# EasyEDA Pro project QFP100测试座转接_2024-04-13.epro

# Schematic Schematic1

## Sheets
1 P1: Create Date: 2024-04-13; Page Name: P1; Project Name: QFP100测试座转接; Schematic Name: Schematic1; Update Date: 2024-04-13; Company: 嘉立创EDA; Page Size: A4; Version: V1.0
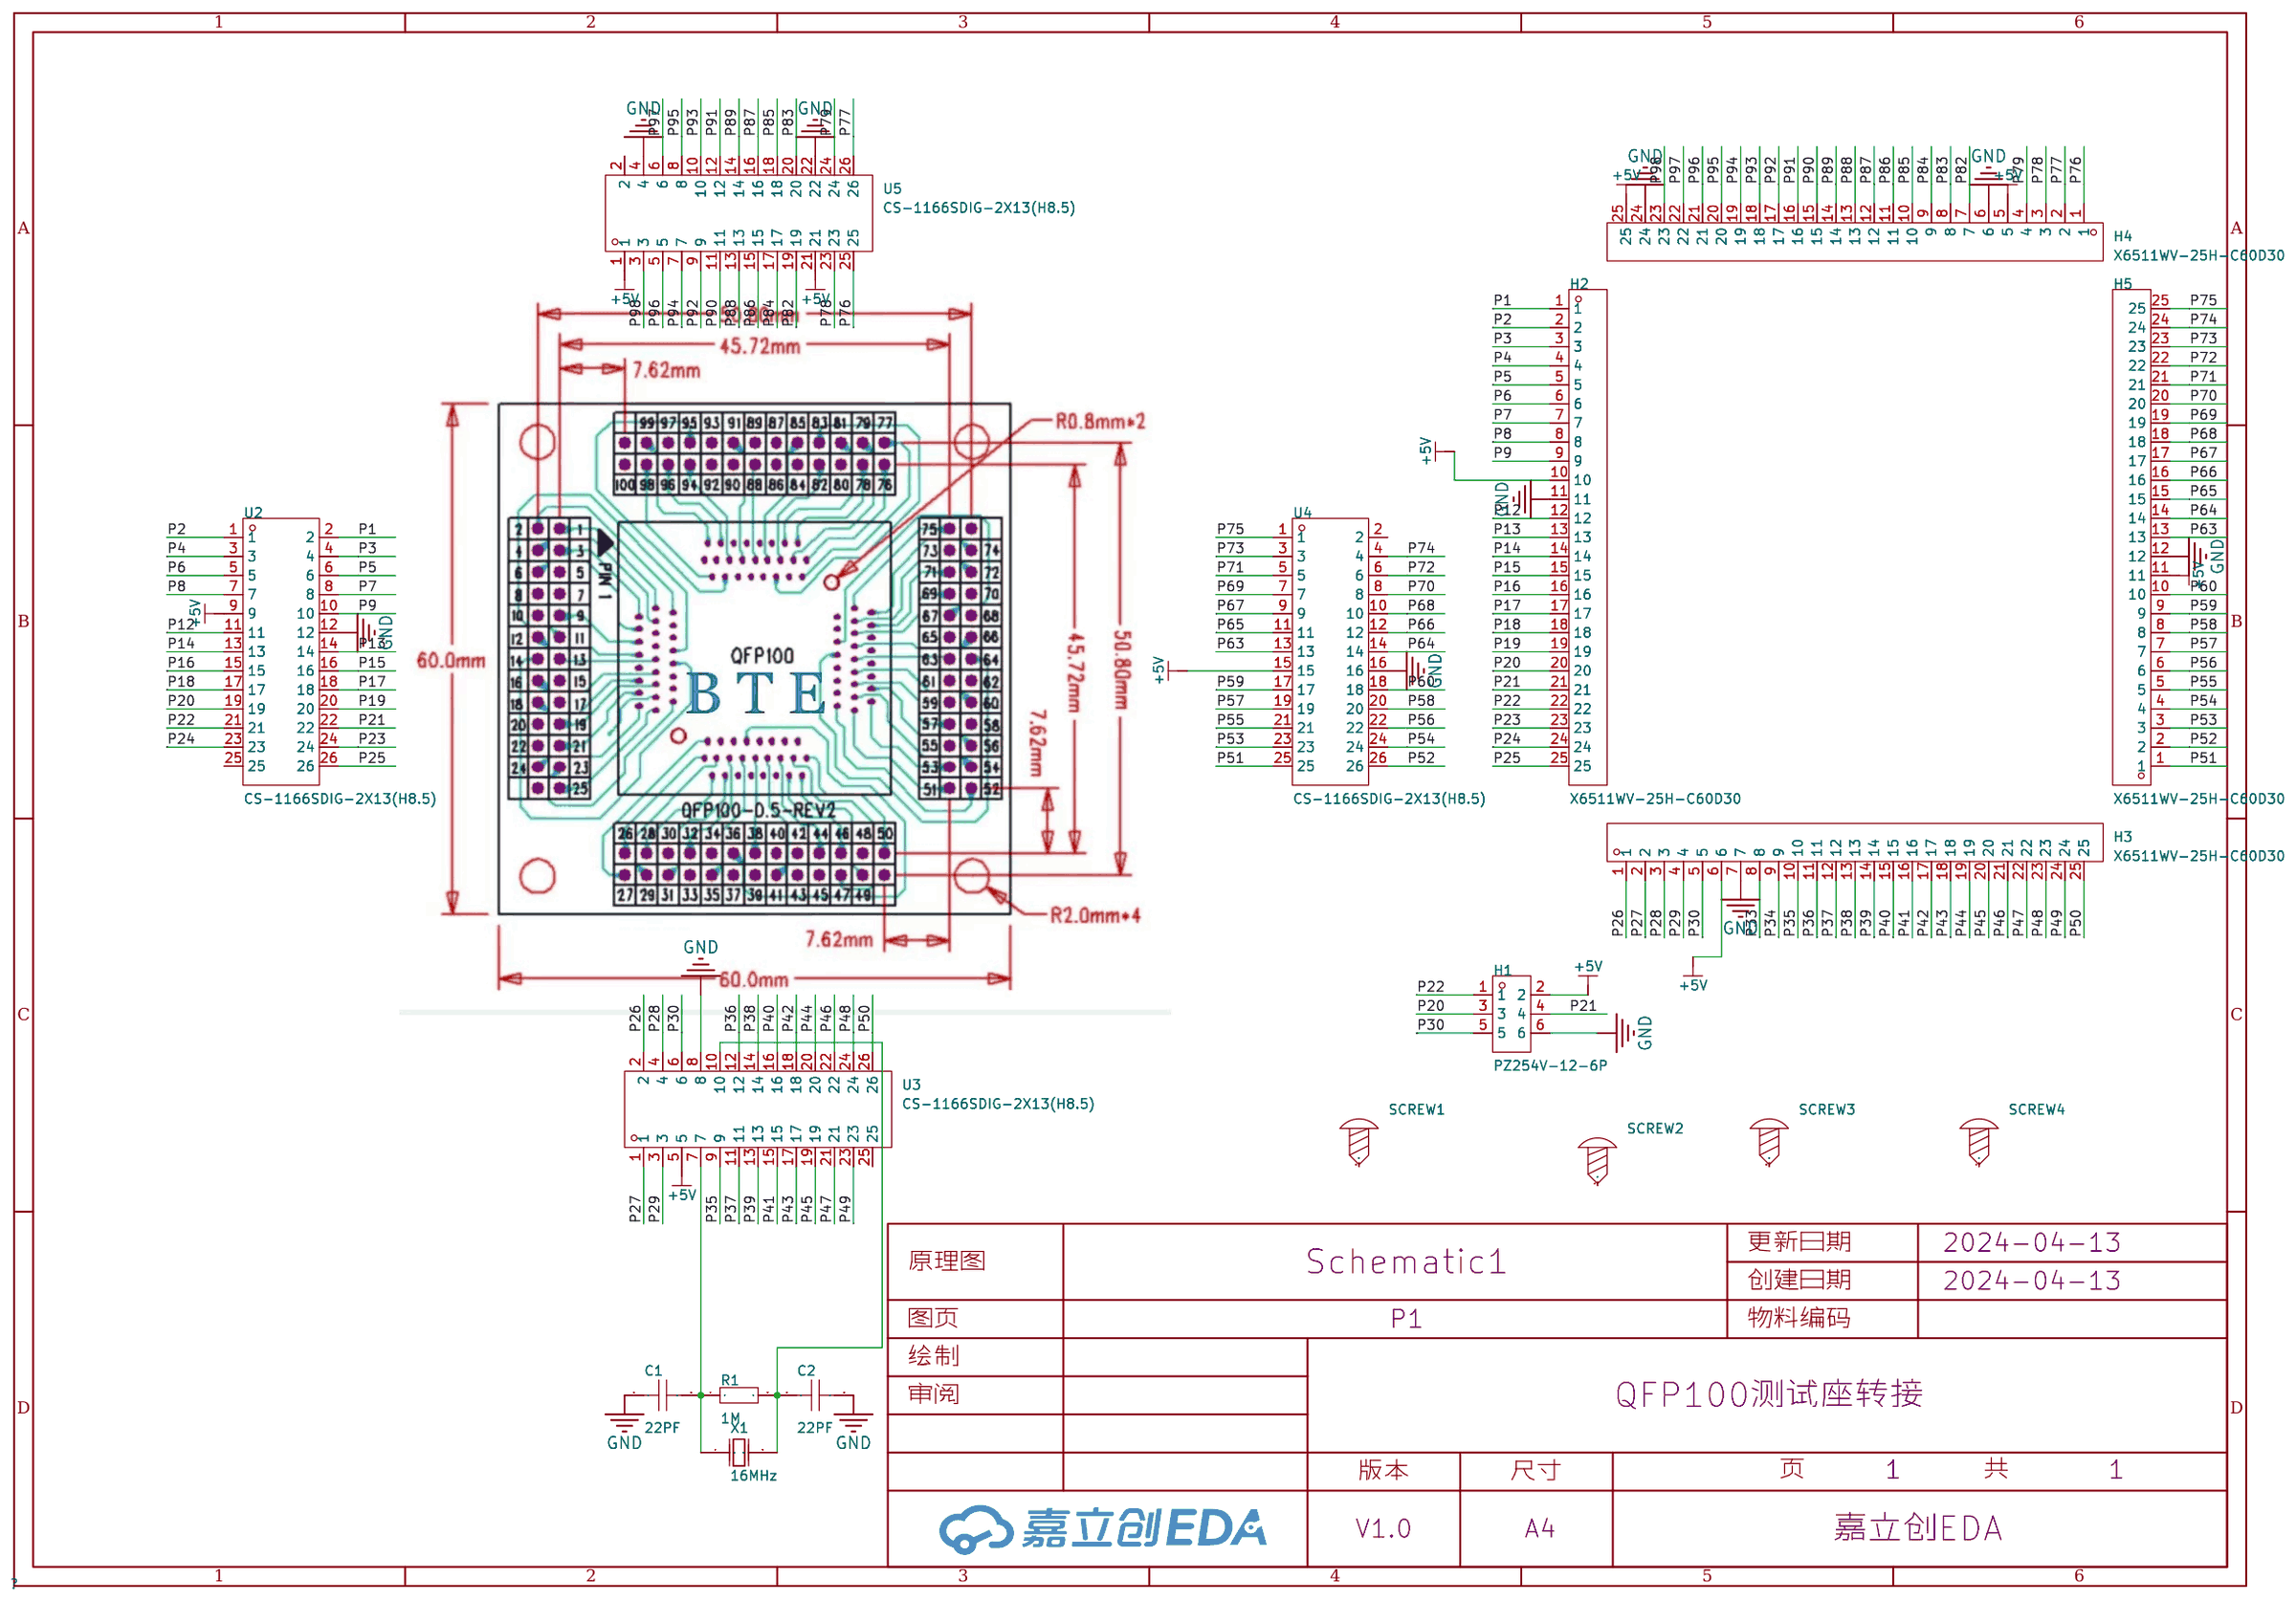
[diagram p0: P1]
2 P2: Page Name: P2
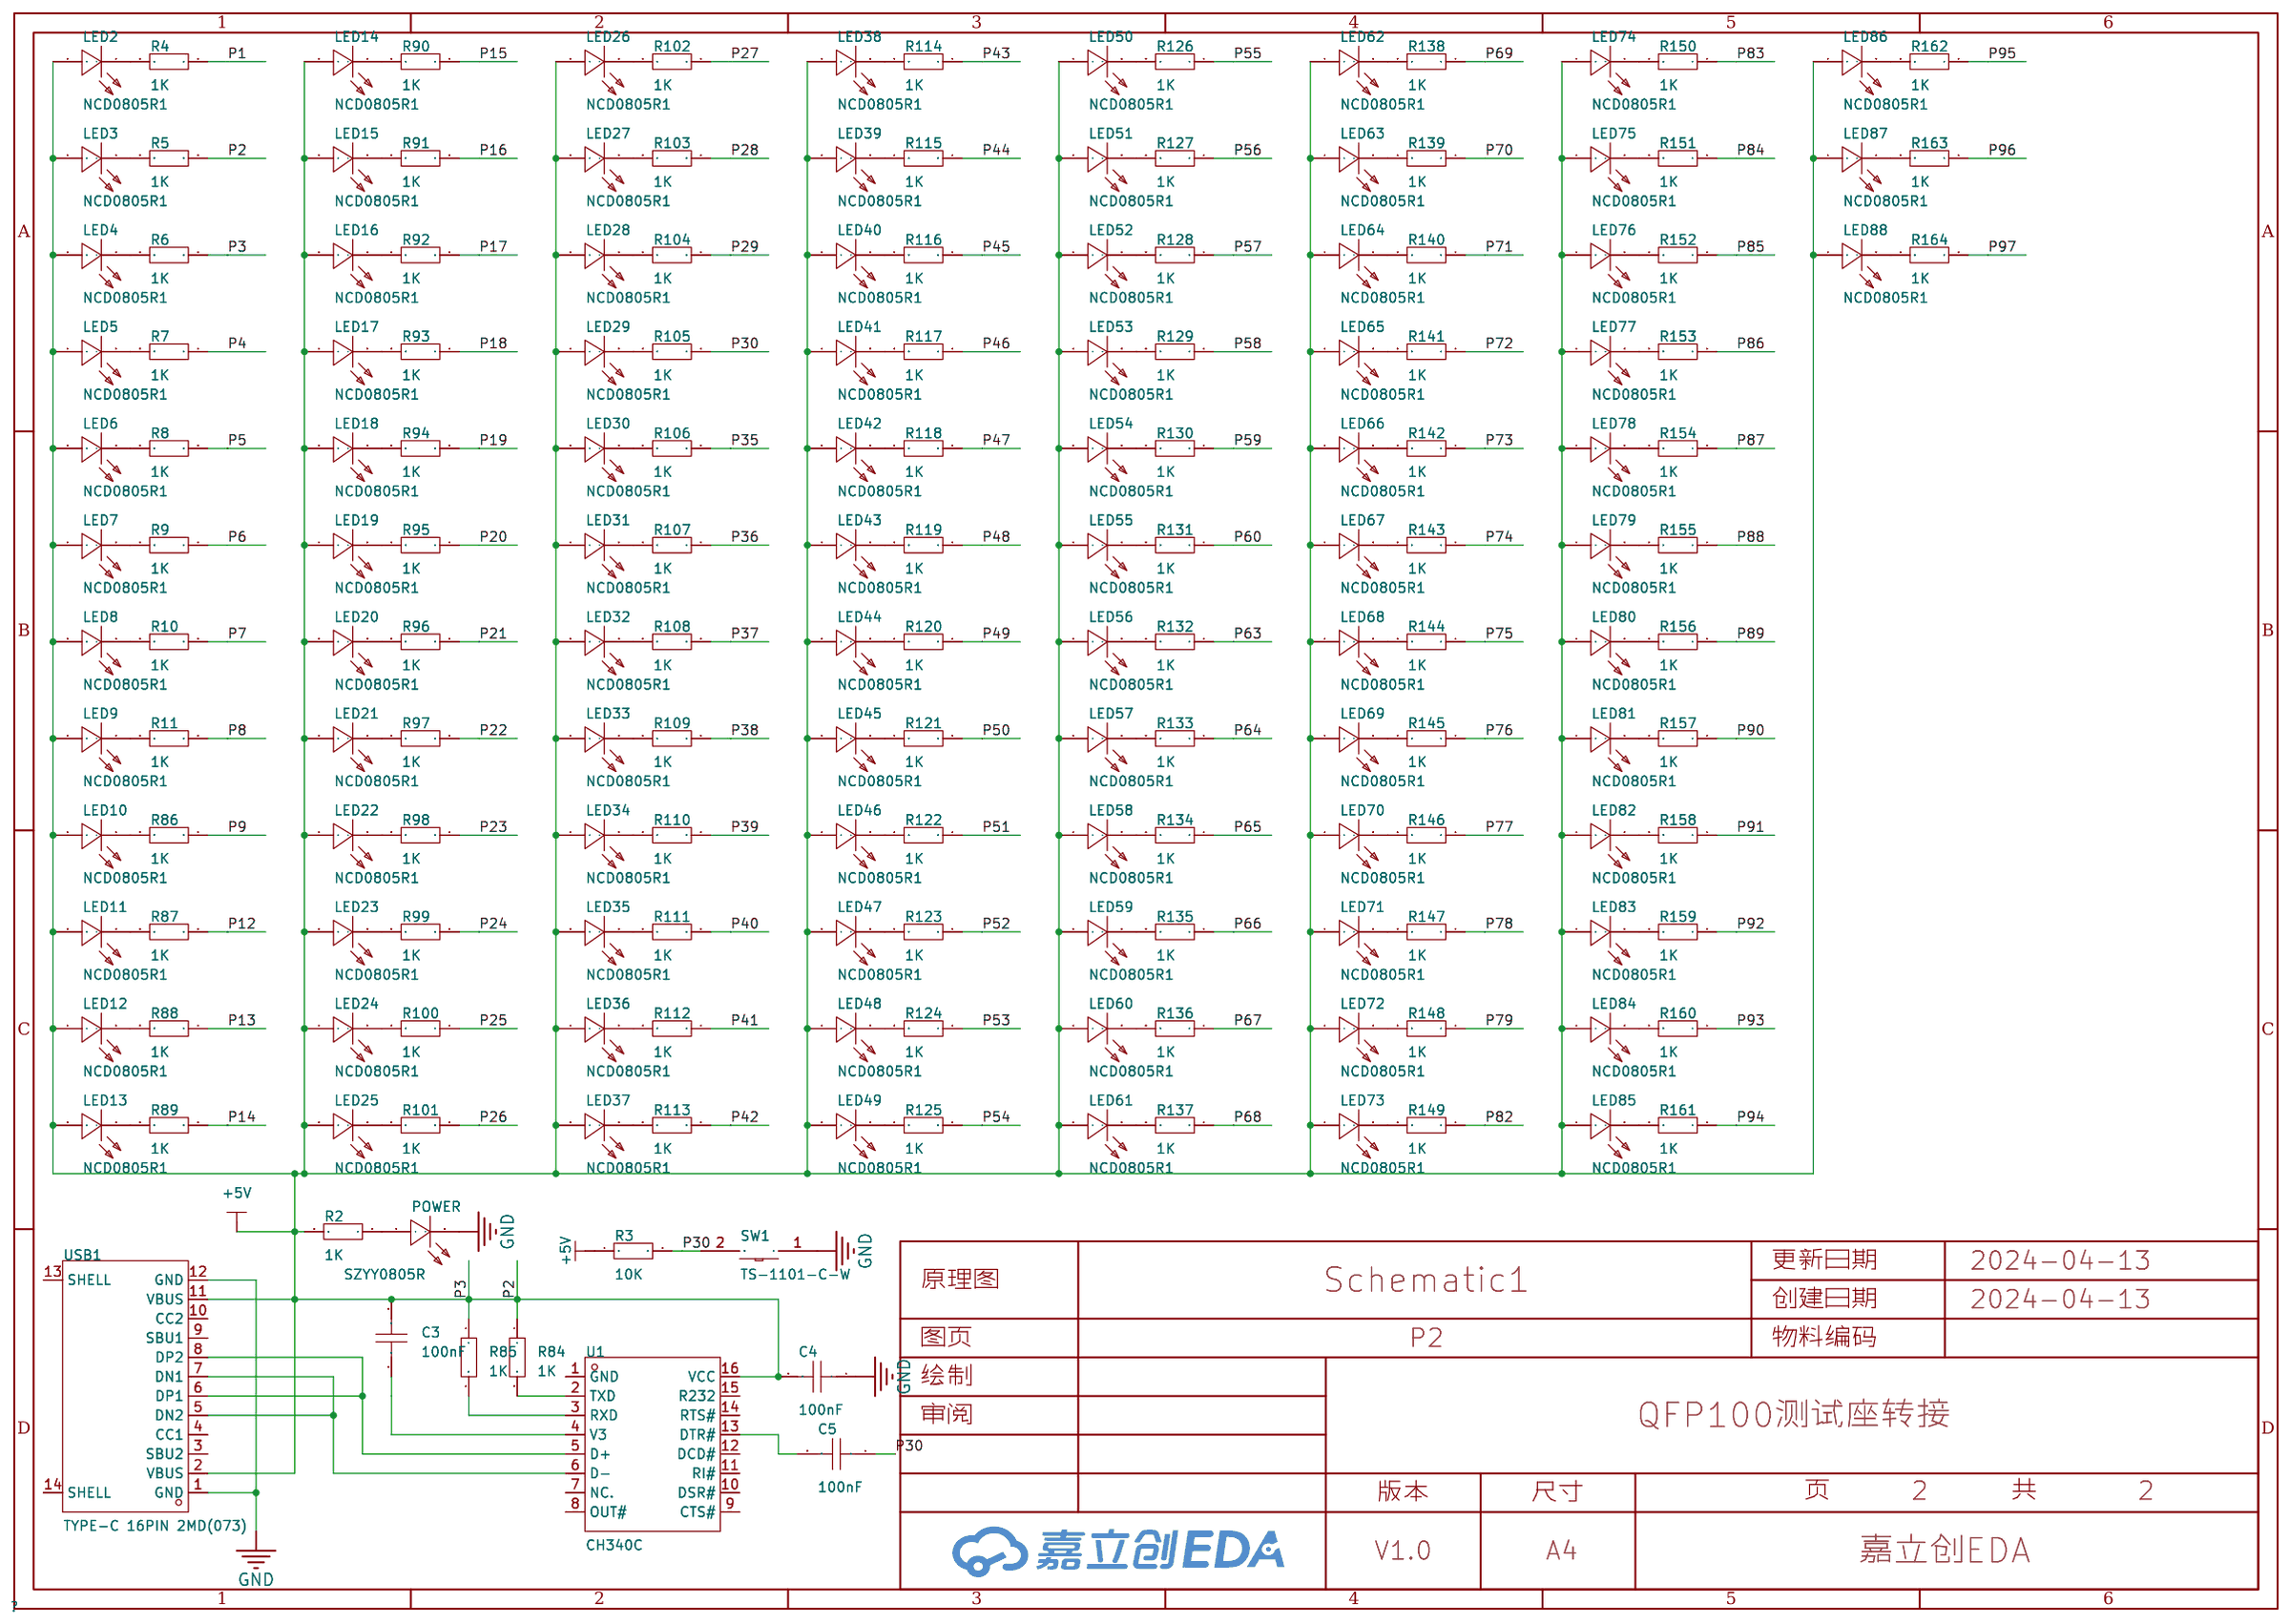
[diagram p1: P2]

## Parts
sheet P1
C1  22PF  [C0805]
C2  22PF  [C0805]
H1  PZ254V-12-6P  [HDR-TH_6P-P2.54-V-M-R2-C3-S2.54]
H2  X6511WV-25H-C60D30  [HDR-TH_25P-P2.54-V-M]
H3  X6511WV-25H-C60D30  [HDR-TH_25P-P2.54-V-M]
H4  X6511WV-25H-C60D30  [HDR-TH_25P-P2.54-V-M]
H5  X6511WV-25H-C60D30  [HDR-TH_25P-P2.54-V-M]
R1  1M  [R0805]
SCREW1  -  [M3螺丝]
SCREW2  -  [M3螺丝]
SCREW3  -  [M3螺丝]
SCREW4  -  [M3螺丝]
U2  CS-1166SDIG-2X13(H8.5)  [HDR-TH_26P-P2.54-V-F-R2-C13-S2.54]
U3  CS-1166SDIG-2X13(H8.5)  [HDR-TH_26P-P2.54-V-F-R2-C13-S2.54]
U4  CS-1166SDIG-2X13(H8.5)  [HDR-TH_26P-P2.54-V-F-R2-C13-S2.54]
U5  CS-1166SDIG-2X13(H8.5)  [HDR-TH_26P-P2.54-V-F-R2-C13-S2.54]
X1  16MHz  [HC-49US_L11.5-W4.5-P4.88]
sheet P2
C3  100nF  [C0805]
C4  100nF  [C0805]
C5  100nF  [C0805]
LED2  NCD0805R1  [LED0805-R-RD]
LED3  NCD0805R1  [LED0805-R-RD]
LED4  NCD0805R1  [LED0805-R-RD]
LED5  NCD0805R1  [LED0805-R-RD]
LED6  NCD0805R1  [LED0805-R-RD]
LED7  NCD0805R1  [LED0805-R-RD]
LED8  NCD0805R1  [LED0805-R-RD]
LED9  NCD0805R1  [LED0805-R-RD]
LED10  NCD0805R1  [LED0805-R-RD]
LED11  NCD0805R1  [LED0805-R-RD]
LED12  NCD0805R1  [LED0805-R-RD]
LED13  NCD0805R1  [LED0805-R-RD]
LED14  NCD0805R1  [LED0805-R-RD]
LED15  NCD0805R1  [LED0805-R-RD]
LED16  NCD0805R1  [LED0805-R-RD]
LED17  NCD0805R1  [LED0805-R-RD]
LED18  NCD0805R1  [LED0805-R-RD]
LED19  NCD0805R1  [LED0805-R-RD]
LED20  NCD0805R1  [LED0805-R-RD]
LED21  NCD0805R1  [LED0805-R-RD]
LED22  NCD0805R1  [LED0805-R-RD]
LED23  NCD0805R1  [LED0805-R-RD]
LED24  NCD0805R1  [LED0805-R-RD]
LED25  NCD0805R1  [LED0805-R-RD]
LED26  NCD0805R1  [LED0805-R-RD]
LED27  NCD0805R1  [LED0805-R-RD]
LED28  NCD0805R1  [LED0805-R-RD]
LED29  NCD0805R1  [LED0805-R-RD]
LED30  NCD0805R1  [LED0805-R-RD]
LED31  NCD0805R1  [LED0805-R-RD]
LED32  NCD0805R1  [LED0805-R-RD]
LED33  NCD0805R1  [LED0805-R-RD]
LED34  NCD0805R1  [LED0805-R-RD]
LED35  NCD0805R1  [LED0805-R-RD]
LED36  NCD0805R1  [LED0805-R-RD]
LED37  NCD0805R1  [LED0805-R-RD]
LED38  NCD0805R1  [LED0805-R-RD]
LED39  NCD0805R1  [LED0805-R-RD]
LED40  NCD0805R1  [LED0805-R-RD]
LED41  NCD0805R1  [LED0805-R-RD]
LED42  NCD0805R1  [LED0805-R-RD]
LED43  NCD0805R1  [LED0805-R-RD]
LED44  NCD0805R1  [LED0805-R-RD]
LED45  NCD0805R1  [LED0805-R-RD]
LED46  NCD0805R1  [LED0805-R-RD]
LED47  NCD0805R1  [LED0805-R-RD]
LED48  NCD0805R1  [LED0805-R-RD]
LED49  NCD0805R1  [LED0805-R-RD]
LED50  NCD0805R1  [LED0805-R-RD]
LED51  NCD0805R1  [LED0805-R-RD]
LED52  NCD0805R1  [LED0805-R-RD]
LED53  NCD0805R1  [LED0805-R-RD]
LED54  NCD0805R1  [LED0805-R-RD]
LED55  NCD0805R1  [LED0805-R-RD]
LED56  NCD0805R1  [LED0805-R-RD]
LED57  NCD0805R1  [LED0805-R-RD]
LED58  NCD0805R1  [LED0805-R-RD]
LED59  NCD0805R1  [LED0805-R-RD]
LED60  NCD0805R1  [LED0805-R-RD]
LED61  NCD0805R1  [LED0805-R-RD]
LED62  NCD0805R1  [LED0805-R-RD]
LED63  NCD0805R1  [LED0805-R-RD]
LED64  NCD0805R1  [LED0805-R-RD]
LED65  NCD0805R1  [LED0805-R-RD]
LED66  NCD0805R1  [LED0805-R-RD]
LED67  NCD0805R1  [LED0805-R-RD]
LED68  NCD0805R1  [LED0805-R-RD]
LED69  NCD0805R1  [LED0805-R-RD]
LED70  NCD0805R1  [LED0805-R-RD]
LED71  NCD0805R1  [LED0805-R-RD]
LED72  NCD0805R1  [LED0805-R-RD]
LED73  NCD0805R1  [LED0805-R-RD]
LED74  NCD0805R1  [LED0805-R-RD]
LED75  NCD0805R1  [LED0805-R-RD]
LED76  NCD0805R1  [LED0805-R-RD]
LED77  NCD0805R1  [LED0805-R-RD]
LED78  NCD0805R1  [LED0805-R-RD]
LED79  NCD0805R1  [LED0805-R-RD]
LED80  NCD0805R1  [LED0805-R-RD]
LED81  NCD0805R1  [LED0805-R-RD]
LED82  NCD0805R1  [LED0805-R-RD]
LED83  NCD0805R1  [LED0805-R-RD]
LED84  NCD0805R1  [LED0805-R-RD]
LED85  NCD0805R1  [LED0805-R-RD]
LED86  NCD0805R1  [LED0805-R-RD]
LED87  NCD0805R1  [LED0805-R-RD]
LED88  NCD0805R1  [LED0805-R-RD]
POWER  SZYY0805R  [LED0805-R-RD]
R2  1K  [R0805]
R3  10K  [R0805]
R4  1K  [R0805]
R5  1K  [R0805]
R6  1K  [R0805]
R7  1K  [R0805]
R8  1K  [R0805]
R9  1K  [R0805]
R10  1K  [R0805]
R11  1K  [R0805]
R84  1K  [R0805]
R85  1K  [R0805]
R86  1K  [R0805]
R87  1K  [R0805]
R88  1K  [R0805]
R89  1K  [R0805]
R90  1K  [R0805]
R91  1K  [R0805]
R92  1K  [R0805]
R93  1K  [R0805]
R94  1K  [R0805]
R95  1K  [R0805]
R96  1K  [R0805]
R97  1K  [R0805]
R98  1K  [R0805]
R99  1K  [R0805]
R100  1K  [R0805]
R101  1K  [R0805]
R102  1K  [R0805]
R103  1K  [R0805]
R104  1K  [R0805]
R105  1K  [R0805]
R106  1K  [R0805]
R107  1K  [R0805]
R108  1K  [R0805]
R109  1K  [R0805]
R110  1K  [R0805]
R111  1K  [R0805]
R112  1K  [R0805]
R113  1K  [R0805]
R114  1K  [R0805]
R115  1K  [R0805]
R116  1K  [R0805]
R117  1K  [R0805]
R118  1K  [R0805]
R119  1K  [R0805]
R120  1K  [R0805]
R121  1K  [R0805]
R122  1K  [R0805]
R123  1K  [R0805]
R124  1K  [R0805]
R125  1K  [R0805]
R126  1K  [R0805]
R127  1K  [R0805]
R128  1K  [R0805]
R129  1K  [R0805]
R130  1K  [R0805]
R131  1K  [R0805]
R132  1K  [R0805]
R133  1K  [R0805]
R134  1K  [R0805]
R135  1K  [R0805]
R136  1K  [R0805]
R137  1K  [R0805]
R138  1K  [R0805]
R139  1K  [R0805]
R140  1K  [R0805]
R141  1K  [R0805]
R142  1K  [R0805]
R143  1K  [R0805]
R144  1K  [R0805]
R145  1K  [R0805]
R146  1K  [R0805]
R147  1K  [R0805]
R148  1K  [R0805]
R149  1K  [R0805]
R150  1K  [R0805]
R151  1K  [R0805]
R152  1K  [R0805]
R153  1K  [R0805]
R154  1K  [R0805]
R155  1K  [R0805]
R156  1K  [R0805]
R157  1K  [R0805]
R158  1K  [R0805]
R159  1K  [R0805]
R160  1K  [R0805]
R161  1K  [R0805]
R162  1K  [R0805]
R163  1K  [R0805]
R164  1K  [R0805]
SW1  TS-1101-C-W  [SW-SMD_L6.0-W3.3-LS8.0]
U1  CH340C  [SOP-16_L10.0-W3.9-P1.27-LS6.0-BL]
USB1  TYPE-C 16PIN 2MD(073)  [USB-C-SMD_TYPE-C-6PIN-2MD-073]

## Library data of the parts
C1 C2 = CAP_0805: Supplier Footprint: 0805
H1 = PZ254V-12-6P: 插针结构:2x3P;间距:2.54mm;行距:2.54mm;圆针/方针:方针;安装类型:直插;排数:双排;总PIN位数:6P;额定电流:-;额定电压:-;配合针长度:6mm;塑高:2.5mm;端接针长度:3mm;触头材质:黄铜;触头镀层:-;工作温度范围:-40℃~+105℃;颜色:黑色;; LCSC Part Name: 间距:2.54mm 2x3P 直插 方针; Supplier Part: C492420; Manufacturer: XFCN(兴飞); Supplier Footprint: 插件,P=2.54mm; JLCPCB Part Class: 扩展库; Datasheet: https://atta.szlcsc.com/upload/public/pdf/source/20200309/C492420_BAECB307B001054C09D200388220EAE6.pdf; Supplier: LCSC; Pin Structure: 2x3P; Pitch: 2.54mm; Row Spacing: 2.54mm; Circluar Pins/Square Pins: 方针; Mounting Type: 直插; Number of Rows: 双排; Number of Pins: 6P; Length of Mating Pin: 6mm; Insulation Height: 2.5mm; Length of End Connection Pin: 3mm; Contact Material: 黄铜; Operating Temperature Range: -40℃~+105℃; Color: 黑色
H2-H5 = X6511WV-25H-C60D30: 插针结构:1x25P;间距:2.54mm;行距:2.54mm;圆针/方针:方针;安装类型:-;排数:单排;总PIN位数:25P;额定电流:3A;额定电压:250V;配合针长度:6mm;塑高:2.5mm;端接针长度:3mm;触头材质:黄铜;触头镀层:金;工作温度范围:-40℃~+105℃;焊接温度(最大值):260℃;颜色:黑色;; LCSC Part Name: 1x25P 间距:2.54mm 方针; Supplier Part: C725957; Manufacturer: XKB Connection(中国星坤); Supplier Footprint: 插件,P=2.54mm; JLCPCB Part Class: 扩展库; Supplier: LCSC; Pin Structure: 1x25P; Pitch: 2.54mm; Row Spacing: 2.54mm; Circluar Pins/Square Pins: 方针; Number of Rows: 单排; Number of Pins: 25P; Current Rating (Max): 3A; Voltage Rating (Max): 250V; Length of Mating Pin: 6mm; Insulation Height: 2.5mm; Length of End Connection Pin: 3mm; Contact Material: 黄铜; Contact Plating: 金; Operating Temperature Range: -40℃~+105℃; Soldering Temperature(Max): 260℃; Color: 黑色
R1-R11 R84-R164 = Res_0805: Supplier Footprint: 0805
SCREW1-SCREW4 = M3螺丝: Supplier Footprint: 插件
U2-U5 = CS-1166SDIG-2X13(H8.5): Supplier Part: C5142853; Manufacturer: CST(永丰盈); Supplier Footprint: 插件,P=2.54mm; JLCPCB Part Class: 扩展库; Datasheet: https://atta.szlcsc.com/upload/public/pdf/source/20220830/38CEF7D55B6A103E6D5907E6B6A4A6EA.pdf; Supplier: LCSC
X1 = X49SD16MSB2SI: 晶振类型:直插晶振;频率:16MHz;常温频差:±10ppm;外接负载电容:20pF;频率稳定度(全温):±30ppm;; LCSC Part Name: 16MHz ±10ppm 20pF; Supplier Part: C188202; Manufacturer: YXC(扬兴晶振); Supplier Footprint: HC-49S; JLCPCB Part Class: 扩展库; Datasheet: https://atta.szlcsc.com/upload/public/pdf/source/20240329/977D7F2434F98B2BE33270BB9FF3D86D.pdf; Supplier: LCSC; Crystal Type: 直插晶振; Normal temperature Frequency Tolerance: ±10ppm; External load capacitor: 20pF; Frequency Stability(Full temperature range): ±30ppm; Operating Temperature: -40℃~+85℃
C3-C5 = 0805B104K500NT: 容值:100nF;精度:±10%;额定电压:50V;材质(温度系数):X7R;; LCSC Part Name: 100nF ±10% 50V; Supplier Part: C38141; Manufacturer: FH(风华); Supplier Footprint: 0805; JLCPCB Part Class: Extended Part; Datasheet: https://atta.szlcsc.com/upload/public/pdf/source/20200305/C486355_26A10D38EF8C2A5C37091D0039909270.pdf; Supplier: LCSC; Tolerance: ±10%; Voltage Rated: 50V; Temperature Coefficient: X7R
LED2-LED88 = NCD0805R1: 灯头类型:-;发光颜色:红色;正向电压(VF):1.6V~2.6V;功率:65mW;正向电流:20mA;主波长:615nm~630nm;二极管配置:独立二极管;透镜颜色:无色透明透镜;色温:-;发光强度:67mcd~195mcd;发光角度:130°;载带方式:-;工作温度:-30℃~+85℃;; Supplier Part: C84256; Manufacturer: 国星光电; Supplier Footprint: 0805; JLCPCB Part Class: 基础库; Datasheet: https://atta.szlcsc.com/upload/public/pdf/source/20200820/C84256_F0A75A43B3EAD75808600A0514C76B99.pdf; Supplier: LCSC; Emitted Color: 红色; Forward Voltage (VF): 1.6V~2.6V; Power Dissipation: 65mW; Forward Current: 20mA; Dominant Wavelength: 615nm~630nm; Diode Configuration: 独立二极管; Lens Color: 无色透明透镜; Luminous Intensity: 67mcd~195mcd; Viewing Angle: 130°; Operating Temperature: -30℃~+85℃
POWER = SZYY0805R: 发光颜色:红色;功率:40mW;正向电流:10mA;主波长:615nm~630nm;二极管配置:-;透镜颜色:无色透明透镜;色温:-;发光角度:120°;载带方式:-;工作温度:-40℃~+85℃;; LCSC Part Name: 红灯; Supplier Part: C434431; Manufacturer: yongyu(永裕光电); Supplier Footprint: 0805; JLCPCB Part Class: 扩展库; Datasheet: https://atta.szlcsc.com/upload/public/pdf/source/20191204/C434431_431C171B758FE4C37FA40B1B295AA7AB.pdf; Supplier: LCSC; Emitted Color: 红色; Power Dissipation: 40mW; Forward Current: 10mA; Dominant Wavelength: 615nm~630nm; Peak Wavelength: 645nm; Lens Color: 无色透明透镜; Viewing Angle: 120°; Operating Temperature: -40℃~+85℃
SW1 = TS-1101-C-W: 电路结构:单刀单掷;按钮形状:矩形按钮;作用力:260gf;安装方式:立贴;开关长度:6mm;开关宽度:3.6mm;开关高度:2.5mm;带支架:不带;触点电流:50mA;额定电压(AC):-;额定电压(DC):12V;额定功率:-;绝缘电阻:-;带灯:无;机械寿命:5万次;; LCSC Part Name: 6*3.6*2.5mm 立贴 轻触开关; Supplier Part: C318938; Manufacturer: XKB Connectivity(中国星坤); Supplier Footprint: SMD; JLCPCB Part Class: 扩展库; Datasheet: https://atta.szlcsc.com/upload/public/pdf/source/20200227/C318938_C2E53B1EEDE37D980A33616AC086DE53.pdf; Supplier: LCSC; Circuit: 单刀单掷; Actuator Style: 矩形按钮; Operating Force: 260gf; Mounting Style: 立贴; Switch Length: 6mm; Switch Width: 3.6mm; Switch Height: 2.5mm; Strike Gundam: 不带; Contact Current: 50mA; Voltage Rating (DC): 12V; Actuator/Cap Color: 白色带淡绿; With Lamp: 无; Mechanical Life: 5万次; Operating Temperature: -30℃~+85℃
U1 = CH340C: 应用功能:收发器;接口协议:USB 2.0;数据速率:2Mbps;; LCSC Part Name: CH340C USB转串口芯片 CH340; Supplier Part: C84681; Manufacturer: WCH(南京沁恒); Supplier Footprint: SOP-16; JLCPCB Part Class: 扩展库; Datasheet: https://atta.szlcsc.com/upload/public/pdf/source/20200819/C84681_ADBED554CE321879DBD6B1D06488689C.pdf; Supplier: LCSC; Applications Function: 收发器; Protocol: USB 2.0; Supply Voltage: 3.3V；5V; Data Rate: 2Mbps
USB1 = TYPE-C 16PIN 2MD(073): 连接器类型:Type-C;标准:-;公母:母;端口数量:1;触点数量:16P;安装方式:卧贴;额定电流 - 电源:5A;工作温度范围:-25℃~+85℃;; LCSC Part Name: Type-C 母 卧贴; Supplier Part: C2765186; Manufacturer: SHOU HAN(首韩); Supplier Footprint: SMD; JLCPCB Part Class: 扩展库; Datasheet: https://atta.szlcsc.com/upload/public/pdf/source/20211123/39B17C16241EAC15C5E277BDA434118E.pdf; Supplier: LCSC; Connector Type: Type-C; Gender: 母; Number of Ports: 1; Number of Contacts: 16P; Mounting Style: 卧贴; Current Rating - Power (Max): 5A; Operating Temperature Range: -25℃~+85℃

## Nets
+5V: C3.2 C4.2 H1.2 H2.10 H3.6 H4.5 H4.25 H5.11 LED2.1(+) LED3.1(+) LED4.1(+) LED5.1(+) LED6.1(+) LED7.1(+) LED8.1(+) LED9.1(+) LED10.1(+) LED11.1(+) LED12.1(+) LED13.1(+) LED14.1(+) LED15.1(+) LED16.1(+) LED17.1(+) LED18.1(+) LED19.1(+) LED20.1(+) LED21.1(+) LED22.1(+) LED23.1(+) LED24.1(+) LED25.1(+) LED26.1(+) LED27.1(+) LED28.1(+) LED29.1(+) LED30.1(+) LED31.1(+) LED32.1(+) LED33.1(+) LED34.1(+) LED35.1(+) LED36.1(+) LED37.1(+) LED38.1(+) LED39.1(+) LED40.1(+) LED41.1(+) LED42.1(+) LED43.1(+) LED44.1(+) LED45.1(+) LED46.1(+) LED47.1(+) LED48.1(+) LED49.1(+) LED50.1(+) LED51.1(+) LED52.1(+) LED53.1(+) LED54.1(+) LED55.1(+) LED56.1(+) LED57.1(+) LED58.1(+) LED59.1(+) LED60.1(+) LED61.1(+) LED62.1(+) LED63.1(+) LED64.1(+) LED65.1(+) LED66.1(+) LED67.1(+) LED68.1(+) LED69.1(+) LED70.1(+) LED71.1(+) LED72.1(+) LED73.1(+) LED74.1(+) LED75.1(+) LED76.1(+) LED77.1(+) LED78.1(+) LED79.1(+) LED80.1(+) LED81.1(+) LED82.1(+) LED83.1(+) LED84.1(+) LED85.1(+) LED86.1(+) LED87.1(+) LED88.1(+) R2.2 R3.1 U1.16(VCC) U2.9 U3.5 U4.15 U5.1 U5.21 USB1.2(VBUS) USB1.11(VBUS)
GND: C1.1 C2.2 C4.1 H1.6 H2.11 H3.7 H4.6 H4.24 H5.12 POWER.2(-) SW1.1 U2.12 U3.8 U4.16 U5.4 U5.22 USB1.1(GND) USB1.12(GND)
P1: H2.1 R4.1 U2.2
P2: H2.2 R5.1 R84.1 U2.1
P3: H2.3 R6.1 R85.1 U2.4
P4: H2.4 R7.1 U2.3
P5: H2.5 R8.1 U2.6
P6: H2.6 R9.1 U2.5
P7: H2.7 R10.1 U2.8
P8: H2.8 R11.1 U2.7
P9: H2.9 R86.1 U2.10
P12: H2.12 R87.1 U2.11
P13: H2.13 R88.1 U2.14
P14: H2.14 R89.1 U2.13
P15: H2.15 R90.1 U2.16
P16: H2.16 R91.1 U2.15
P17: H2.17 R92.1 U2.18
P18: H2.18 R93.1 U2.17
P19: H2.19 R94.1 U2.20
P20: H1.3 H2.20 R95.1 U2.19
P21: H1.4 H2.21 R96.1 U2.22
P22: H1.1 H2.22 R97.1 U2.21
P23: H2.23 R98.1 U2.24
P24: H2.24 R99.1 U2.23
P25: H2.25 R100.1 U2.26
P26: H3.1 R101.1 U3.2
P27: H3.2 R102.1 U3.1
P28: H3.3 R103.1 U3.4
P29: H3.4 R104.1 U3.3
P30: C5.1 H1.5 H3.5 R3.2 R105.1 SW1.2 U3.6
P33: H3.8
P34: H3.9
P35: H3.10 R106.1 U3.9
P36: H3.11 R107.1 U3.12
P37: H3.12 R108.1 U3.11
P38: H3.13 R109.1 U3.14
P39: H3.14 R110.1 U3.13
P40: H3.15 R111.1 U3.16
P41: H3.16 R112.1 U3.15
P42: H3.17 R113.1 U3.18
P43: H3.18 R114.1 U3.17
P44: H3.19 R115.1 U3.20
P45: H3.20 R116.1 U3.19
P46: H3.21 R117.1 U3.22
P47: H3.22 R118.1 U3.21
P48: H3.23 R119.1 U3.24
P49: H3.24 R120.1 U3.23
P50: H3.25 R121.1 U3.26
P51: H5.1 R122.1 U4.25
P52: H5.2 R123.1 U4.26
P53: H5.3 R124.1 U4.23
P54: H5.4 R125.1 U4.24
P55: H5.5 R126.1 U4.21
P56: H5.6 R127.1 U4.22
P57: H5.7 R128.1 U4.19
P58: H5.8 R129.1 U4.20
P59: H5.9 R130.1 U4.17
P60: H5.10 R131.1 U4.18
P63: H5.13 R132.1 U4.13
P64: H5.14 R133.1 U4.14
P65: H5.15 R134.1 U4.11
P66: H5.16 R135.1 U4.12
P67: H5.17 R136.1 U4.9
P68: H5.18 R137.1 U4.10
P69: H5.19 R138.1 U4.7
P70: H5.20 R139.1 U4.8
P71: H5.21 R140.1 U4.5
P72: H5.22 R141.1 U4.6
P73: H5.23 R142.1 U4.3
P74: H5.24 R143.1 U4.4
P75: H5.25 R144.1 U4.1
P76: H4.1 R145.1 U5.25
P77: H4.2 R146.1 U5.26
P78: H4.3 R147.1 U5.23
P79: H4.4 R148.1 U5.24
P82: H4.7 R149.1 U5.19
P83: H4.8 R150.1 U5.20
P84: H4.9 R151.1 U5.17
P85: H4.10 R152.1 U5.18
P86: H4.11 R153.1 U5.15
P87: H4.12 R154.1 U5.16
P88: H4.13 R155.1 U5.13
P89: H4.14 R156.1 U5.14
P90: H4.15 R157.1 U5.11
P91: H4.16 R158.1 U5.12
P92: H4.17 R159.1 U5.9
P93: H4.18 R160.1 U5.10
P94: H4.19 R161.1 U5.7
P95: H4.20 R162.1 U5.8
P96: H4.21 R163.1 U5.5
P97: H4.22 R164.1 U5.6
P98: H4.23 U5.3
$1N976: C1.2 R1.1 U3.7 X1.1(OSC1)
$1N982: C2.1 R1.2 U3.10 X1.2(OSC2)
$2N435: U1.6(D-) USB1.5(DN2) USB1.7(DN1)
$2N446: U1.5(D+) USB1.6(DP1) USB1.8(DP2)
$2N524: C3.1 U1.4(V3)
$2N618: C5.2 U1.13(DTR#)
$2N737: POWER.1(+) R2.1
$2N7582: R84.2 U1.2(TXD)
$2N7585: R85.2 U1.3(RXD)
$2N10376: LED2.2(-) R4.2
$2N10378: LED3.2(-) R5.2
$2N10380: LED4.2(-) R6.2
$2N10382: LED5.2(-) R7.2
$2N10384: LED6.2(-) R8.2
$2N10386: LED7.2(-) R9.2
$2N10388: LED8.2(-) R10.2
$2N10390: LED9.2(-) R11.2
$2N10669: LED10.2(-) R86.2
$2N10671: LED11.2(-) R87.2
$2N10673: LED12.2(-) R88.2
$2N10675: LED13.2(-) R89.2
$2N11540: LED14.2(-) R90.2
$2N11542: LED15.2(-) R91.2
$2N11544: LED16.2(-) R92.2
$2N11546: LED17.2(-) R93.2
$2N11548: LED18.2(-) R94.2
$2N11550: LED19.2(-) R95.2
$2N11552: LED20.2(-) R96.2
$2N11554: LED21.2(-) R97.2
$2N11556: LED22.2(-) R98.2
$2N11558: LED23.2(-) R99.2
$2N11560: LED24.2(-) R100.2
$2N11562: LED25.2(-) R101.2
$2N14065: LED26.2(-) R102.2
$2N14067: LED27.2(-) R103.2
$2N14069: LED28.2(-) R104.2
$2N14071: LED29.2(-) R105.2
$2N14073: LED30.2(-) R106.2
$2N14075: LED31.2(-) R107.2
$2N14077: LED32.2(-) R108.2
$2N14079: LED33.2(-) R109.2
$2N14081: LED34.2(-) R110.2
$2N14083: LED35.2(-) R111.2
$2N14085: LED36.2(-) R112.2
$2N14087: LED37.2(-) R113.2
$2N14910: LED38.2(-) R114.2
$2N14912: LED39.2(-) R115.2
$2N14914: LED40.2(-) R116.2
$2N14916: LED41.2(-) R117.2
$2N14918: LED42.2(-) R118.2
$2N14920: LED43.2(-) R119.2
$2N14922: LED44.2(-) R120.2
$2N14924: LED45.2(-) R121.2
$2N14926: LED46.2(-) R122.2
$2N14928: LED47.2(-) R123.2
$2N14930: LED48.2(-) R124.2
$2N14932: LED49.2(-) R125.2
$2N15750: LED50.2(-) R126.2
$2N15752: LED51.2(-) R127.2
$2N15754: LED52.2(-) R128.2
$2N15756: LED53.2(-) R129.2
$2N15758: LED54.2(-) R130.2
$2N15760: LED55.2(-) R131.2
$2N15762: LED56.2(-) R132.2
$2N15764: LED57.2(-) R133.2
$2N15766: LED58.2(-) R134.2
$2N15768: LED59.2(-) R135.2
$2N15770: LED60.2(-) R136.2
$2N15772: LED61.2(-) R137.2
$2N16590: LED62.2(-) R138.2
$2N16592: LED63.2(-) R139.2
$2N16594: LED64.2(-) R140.2
$2N16596: LED65.2(-) R141.2
$2N16598: LED66.2(-) R142.2
$2N16600: LED67.2(-) R143.2
$2N16602: LED68.2(-) R144.2
$2N16604: LED69.2(-) R145.2
$2N16606: LED70.2(-) R146.2
$2N16608: LED71.2(-) R147.2
$2N16610: LED72.2(-) R148.2
$2N16612: LED73.2(-) R149.2
$2N17430: LED74.2(-) R150.2
$2N17432: LED75.2(-) R151.2
$2N17434: LED76.2(-) R152.2
$2N17436: LED77.2(-) R153.2
$2N17438: LED78.2(-) R154.2
$2N17440: LED79.2(-) R155.2
$2N17442: LED80.2(-) R156.2
$2N17444: LED81.2(-) R157.2
$2N17446: LED82.2(-) R158.2
$2N17448: LED83.2(-) R159.2
$2N17450: LED84.2(-) R160.2
$2N17452: LED85.2(-) R161.2
$2N18270: LED86.2(-) R162.2
$2N18272: LED87.2(-) R163.2
$2N18274: LED88.2(-) R164.2

Not connected (* = marked no-connect by the designer): SCREW1 1; SCREW2 1; SCREW3 1; SCREW4 1; U1 1(GND) 7(NC.) 8(OUT#) 9(CTS#) 10(DSR#) 11(RI#) 12(DCD#) 14(RTS#) 15(R232); U2 25; U3 25; U4 2; U5 2; USB1 3(SBU2) 4(CC1) 9(SBU1) 10(CC2) 13(SHELL) 14(SHELL)

# Board PCB1
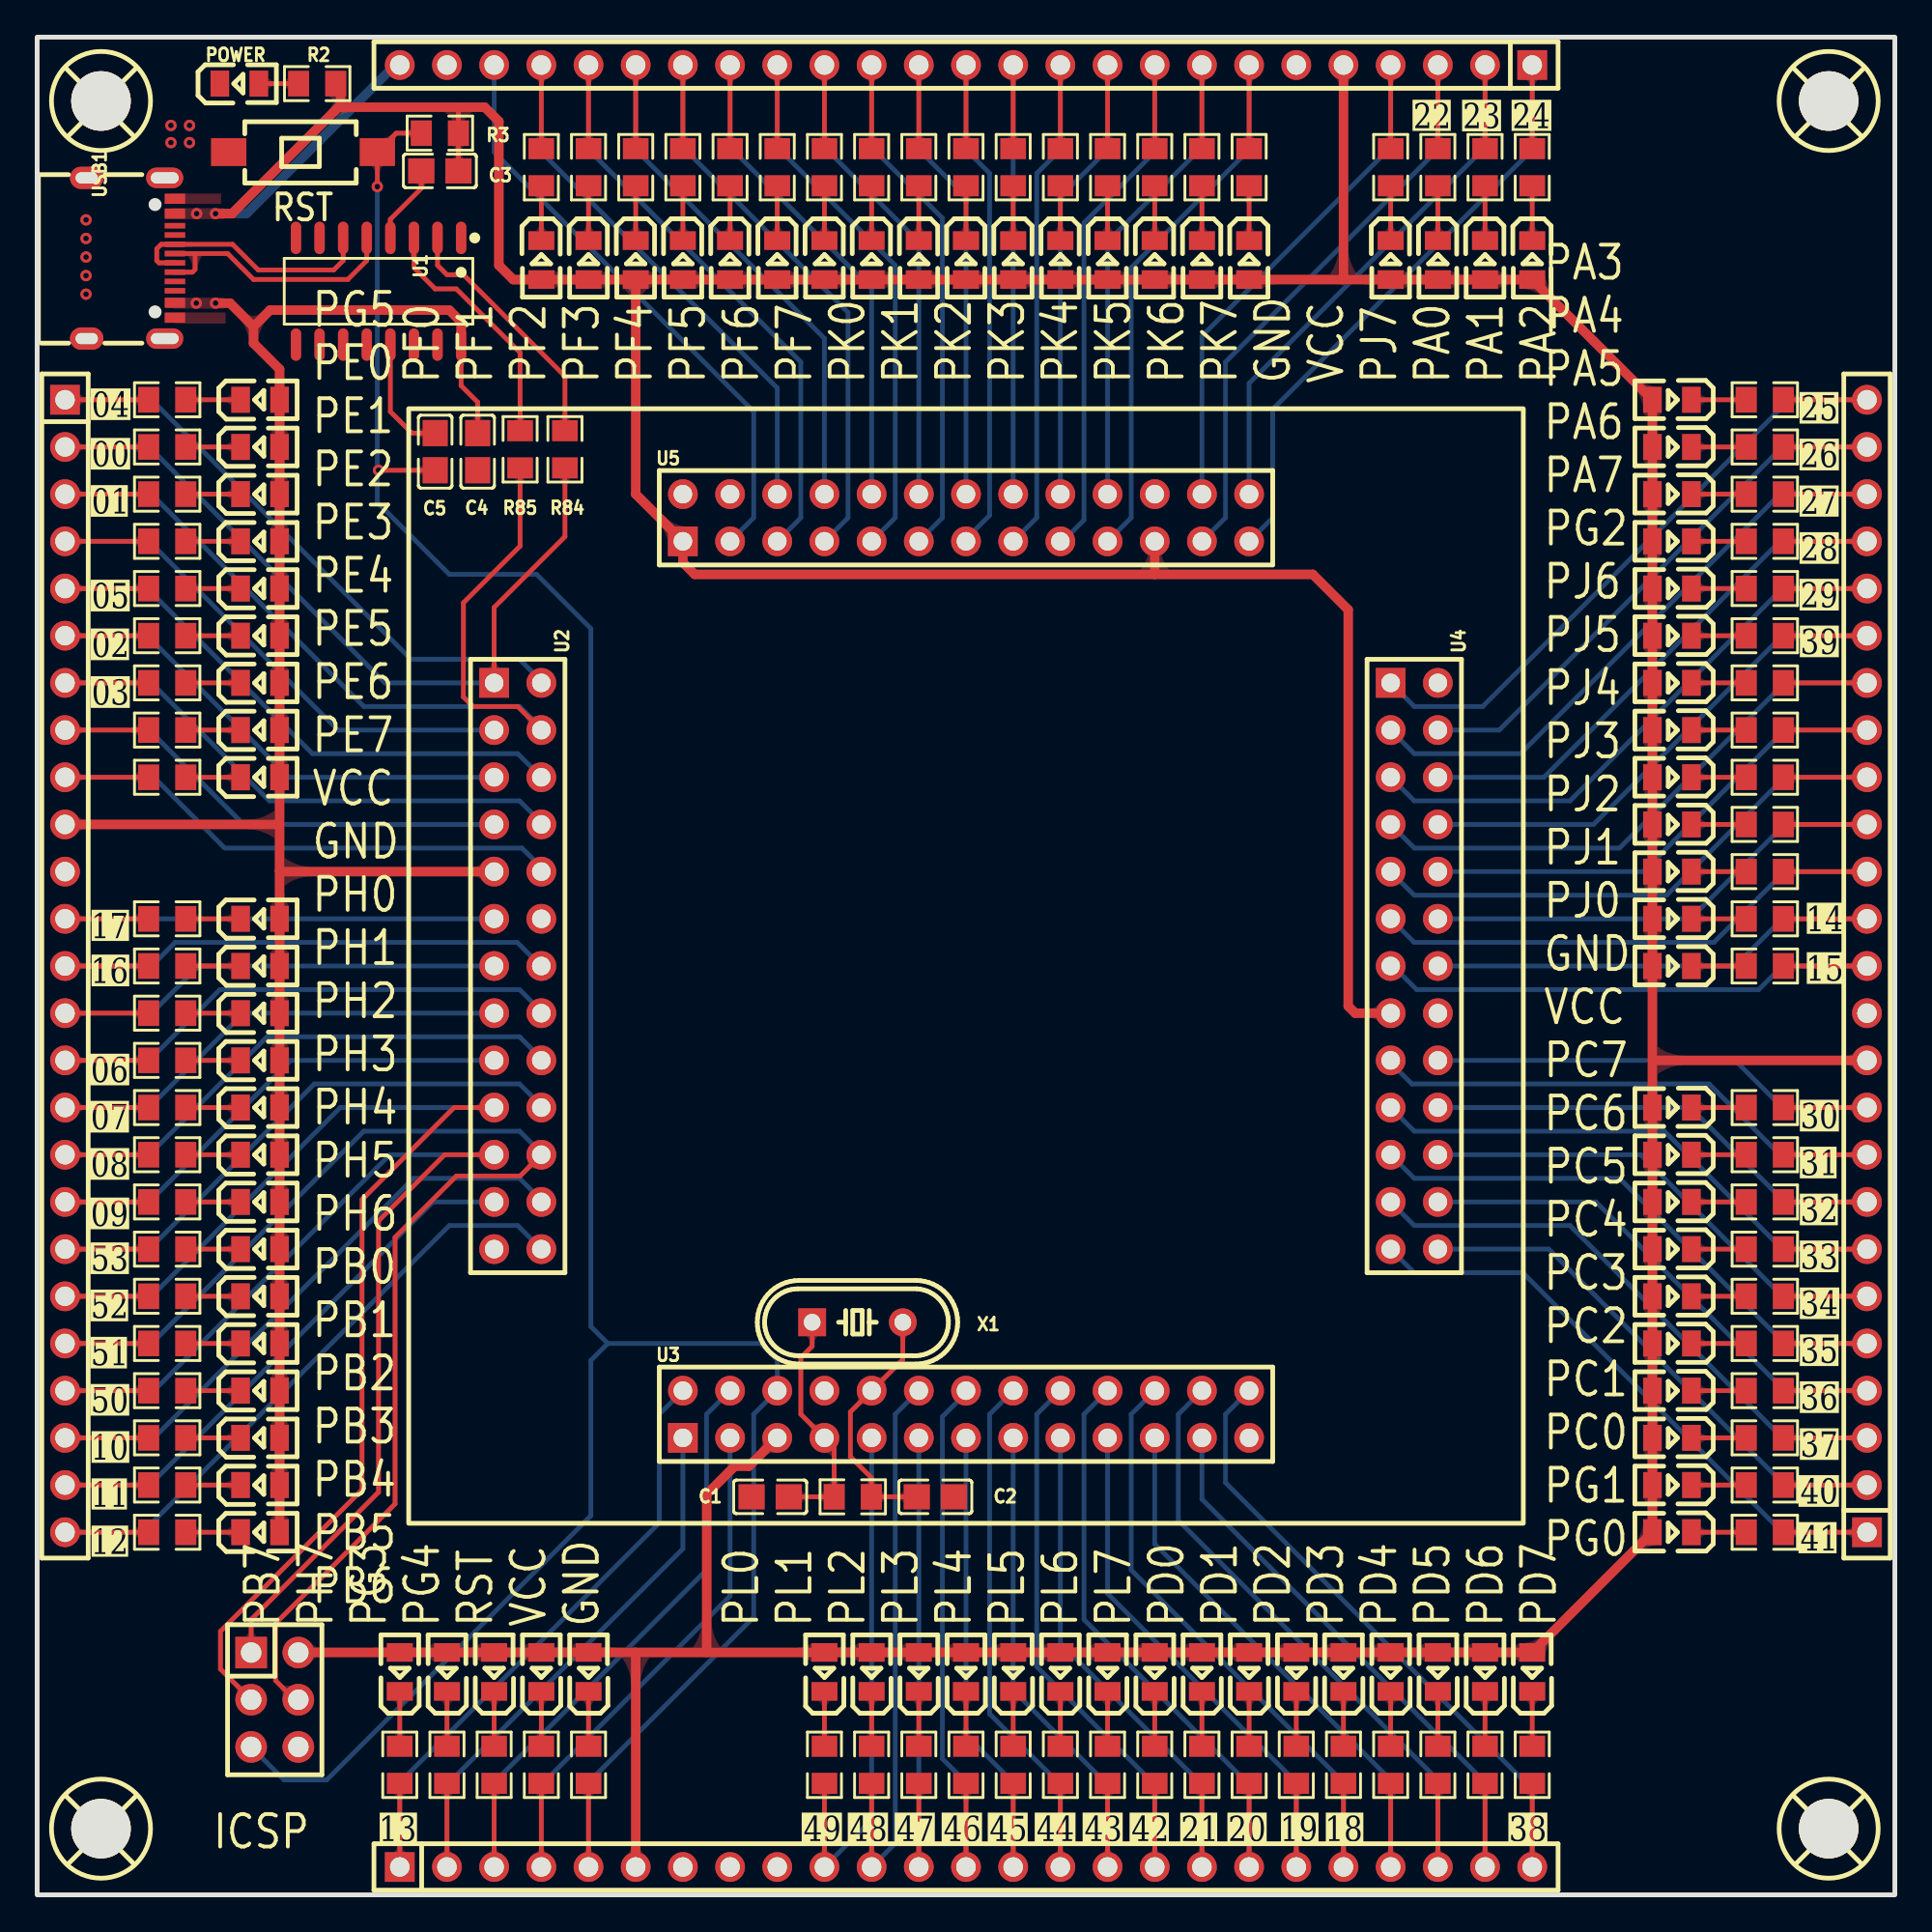
[diagram p2: board, top side]
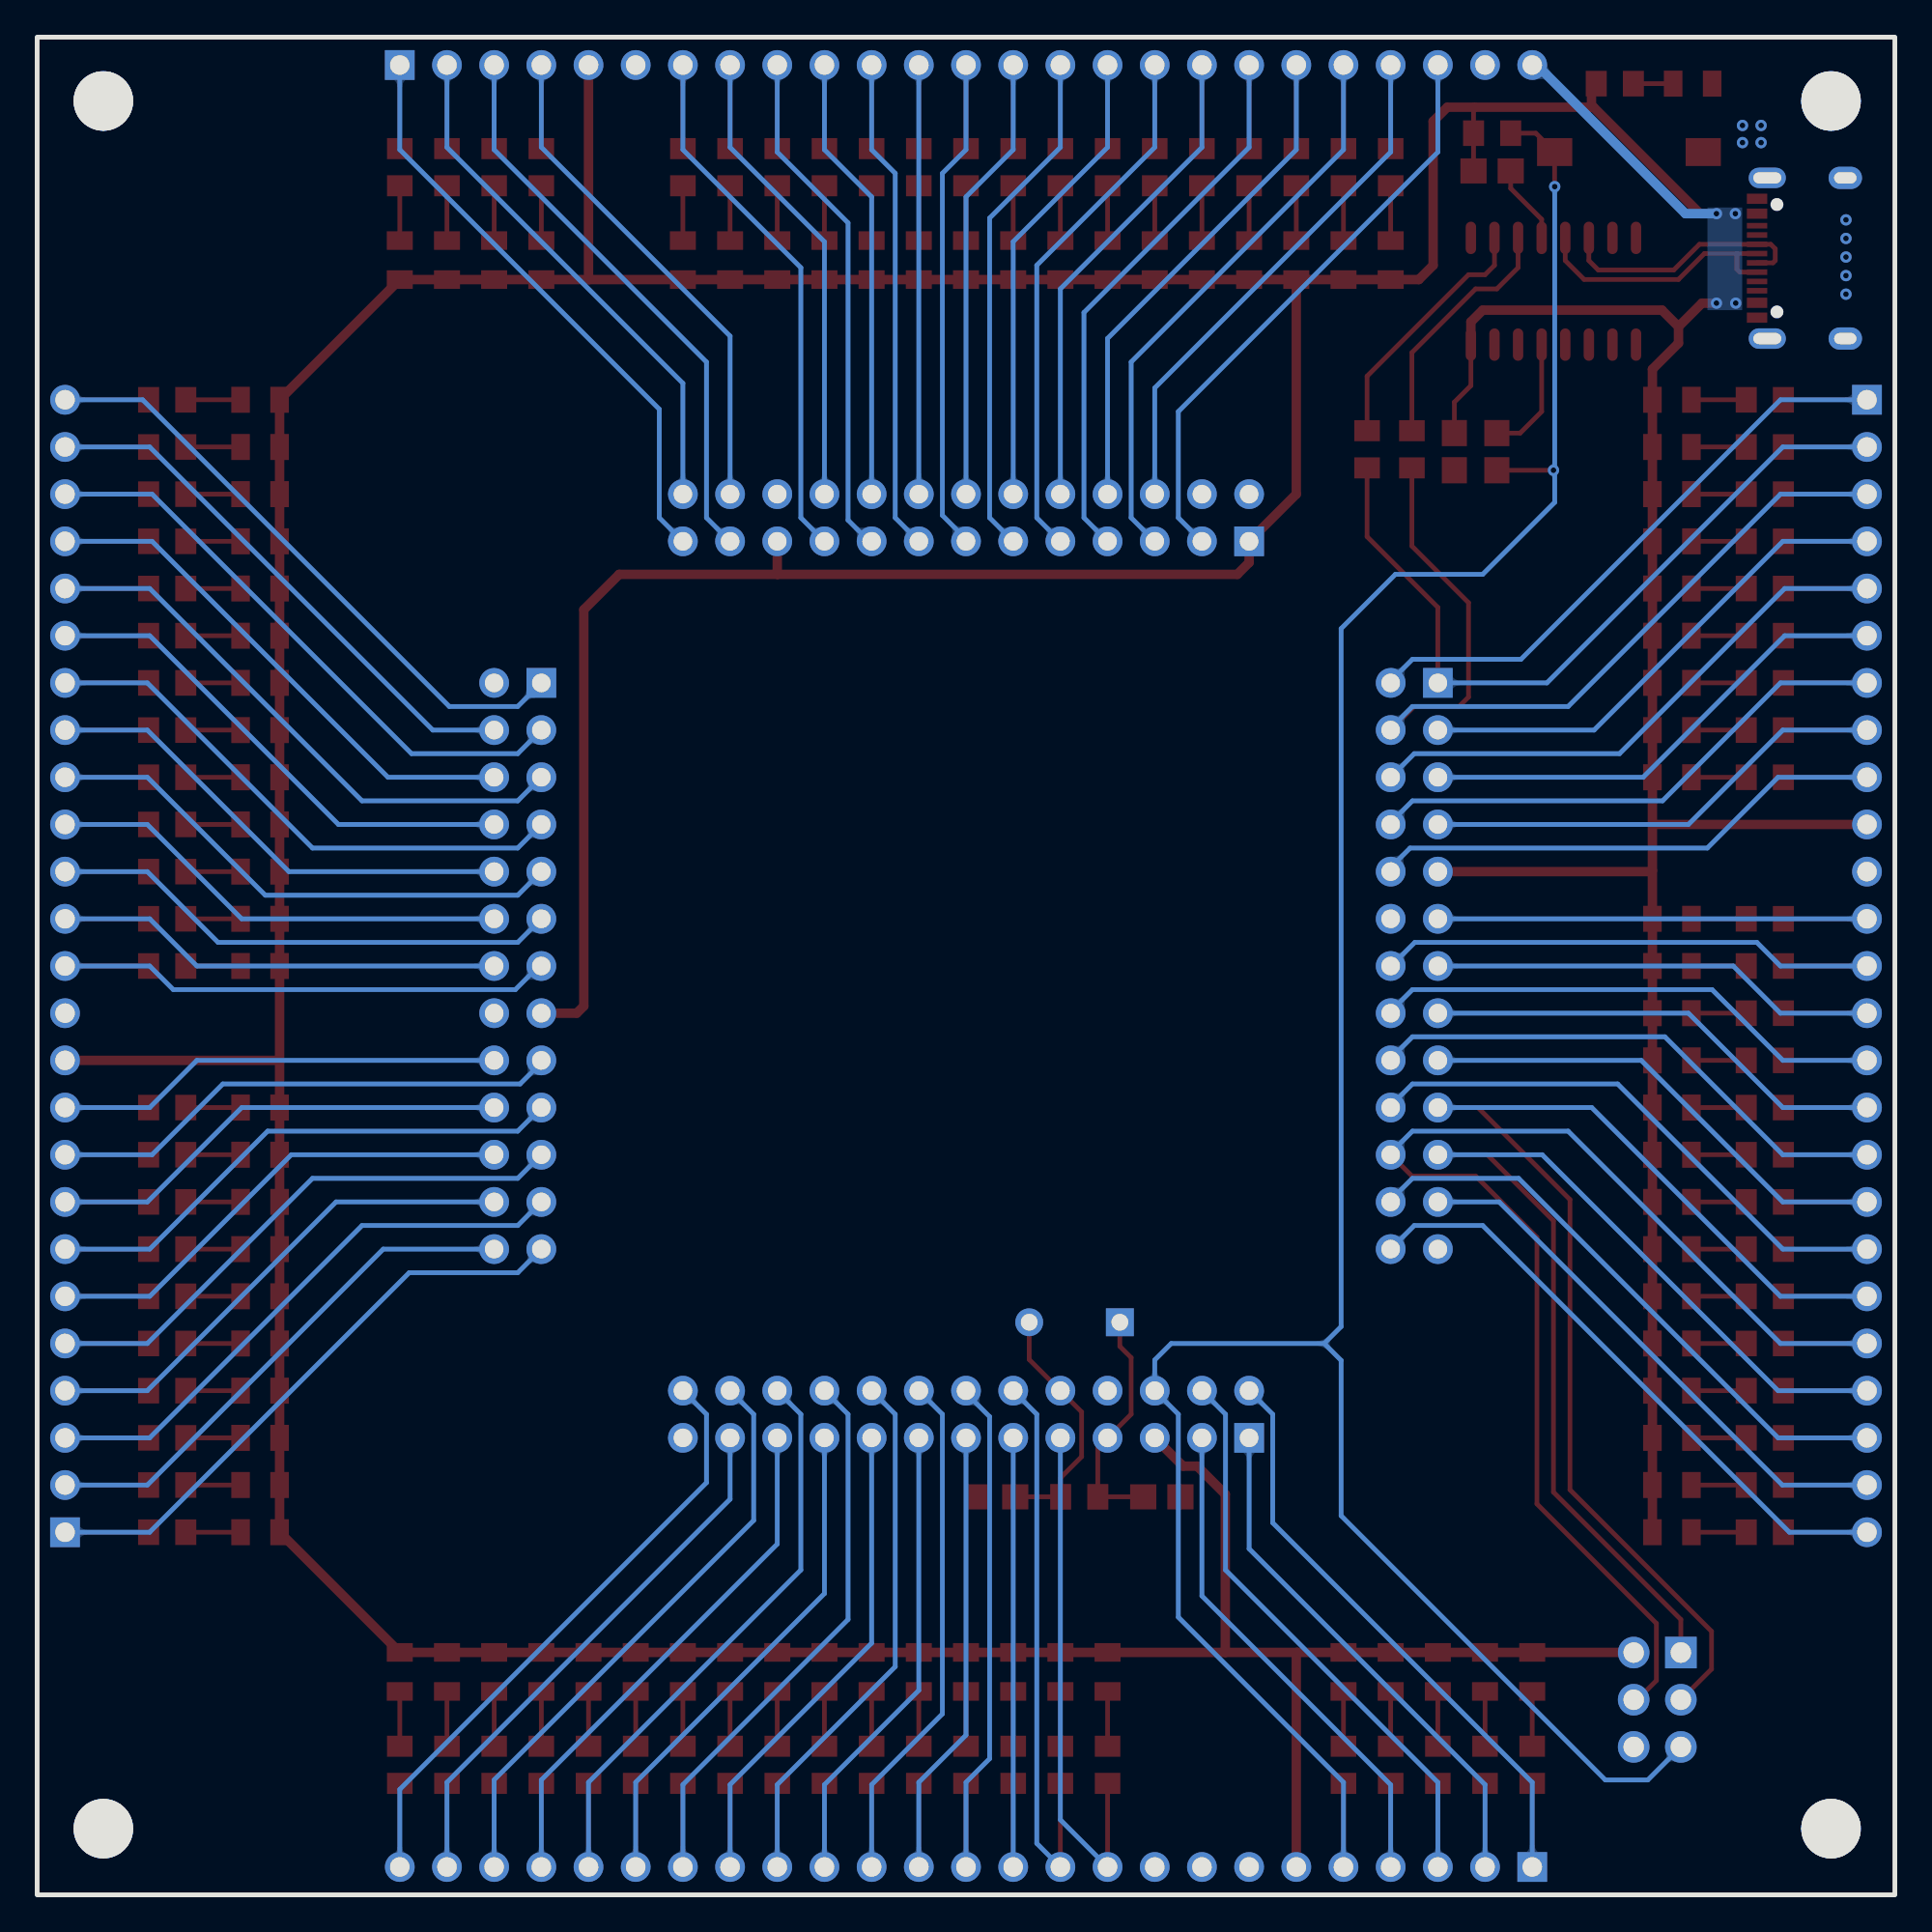
[diagram p3: board, bottom side, seen from below]

Outline 100 x 100 mm; copper layers: Top Layer, Bottom Layer. Coordinates in mm from the lower left corner of the outline.
Outline path: rectangle 0,100 100,0
Stack: Top Layer 0.035mm / Dielectric1 1.51mm FR4 er 4.5 / Bottom Layer 0.035mm

## Design rules (mm)
template: JLCPCB Capability(Two Layers Board)
spacing copperThickness1oz (default): track to track 0.102, other pairs 0.152 to 0.3
spacing copperThickness2oz: track to track 0.203, other pairs 0.152 to 0.3
track width copperThickness1oz (default): min 0.127, default 0.254, max 2.54
track width copperThickness2oz: min 0.203, default 0.254, max 2.54
differential pair differentialPair (default): width min 0.127, default 0.254, max 2.54; gap min 0.152, default 0.152
via viaSize (default): diameter min 0.5, default 0.61, max 10; hole min 0.3, default 0.305, max 6.3

## Placement (name value [footprint] x y rotation side)
C1  22PF  [C0805]  39.46 21.43 0 top
C2  22PF  [C0805]  48.35 21.43 0 top
C3  100nF  [C0805]  21.68 92.8 0 top
C4  100nF  [C0805]  23.71 77.69 90 top
C5  100nF  [C0805]  21.42 77.69 90 top
H1  PZ254V-12-6P  [HDR-TH_6P-P2.54-V-M-R2-C3-S2.54]  12.79 10.5 270 top
H2  X6511WV-25H-C60D30  [HDR-TH_25P-P2.54-V-M]  1.5 50 270 top
H3  X6511WV-25H-C60D30  [HDR-TH_25P-P2.54-V-M]  50 1.5 0 top
H4  X6511WV-25H-C60D30  [HDR-TH_25P-P2.54-V-M]  50 98.5 180 top
H5  X6511WV-25H-C60D30  [HDR-TH_25P-P2.54-V-M]  98.5 50 90 top
LED2  NCD0805R1  [LED0805-R-RD]  12 80.48 0 top
LED3  NCD0805R1  [LED0805-R-RD]  12 77.94 0 top
LED4  NCD0805R1  [LED0805-R-RD]  12 75.4 0 top
LED5  NCD0805R1  [LED0805-R-RD]  12 72.86 0 top
LED6  NCD0805R1  [LED0805-R-RD]  12 70.32 0 top
LED7  NCD0805R1  [LED0805-R-RD]  12 67.78 0 top
LED8  NCD0805R1  [LED0805-R-RD]  12 65.24 0 top
LED9  NCD0805R1  [LED0805-R-RD]  12 62.7 0 top
LED10  NCD0805R1  [LED0805-R-RD]  12 60.16 0 top
LED11  NCD0805R1  [LED0805-R-RD]  12 52.54 0 top
LED12  NCD0805R1  [LED0805-R-RD]  12 50 0 top
LED13  NCD0805R1  [LED0805-R-RD]  12 47.46 0 top
LED14  NCD0805R1  [LED0805-R-RD]  12 44.92 0 top
LED15  NCD0805R1  [LED0805-R-RD]  12 42.38 0 top
LED16  NCD0805R1  [LED0805-R-RD]  12 39.84 0 top
LED17  NCD0805R1  [LED0805-R-RD]  12 37.3 0 top
LED18  NCD0805R1  [LED0805-R-RD]  12 34.76 0 top
LED19  NCD0805R1  [LED0805-R-RD]  12 32.22 0 top
LED20  NCD0805R1  [LED0805-R-RD]  12 29.68 0 top
LED21  NCD0805R1  [LED0805-R-RD]  12 27.14 0 top
LED22  NCD0805R1  [LED0805-R-RD]  12 24.6 0 top
LED23  NCD0805R1  [LED0805-R-RD]  12 22.06 0 top
LED24  NCD0805R1  [LED0805-R-RD]  12 19.52 0 top
LED25  NCD0805R1  [LED0805-R-RD]  19.52 12 90 top
LED26  NCD0805R1  [LED0805-R-RD]  22.06 12 90 top
LED27  NCD0805R1  [LED0805-R-RD]  24.6 12 90 top
LED28  NCD0805R1  [LED0805-R-RD]  27.14 12 90 top
LED29  NCD0805R1  [LED0805-R-RD]  29.68 12 90 top
LED30  NCD0805R1  [LED0805-R-RD]  42.38 12 90 top
LED31  NCD0805R1  [LED0805-R-RD]  44.92 12 90 top
LED32  NCD0805R1  [LED0805-R-RD]  47.46 12 90 top
LED33  NCD0805R1  [LED0805-R-RD]  50 12 90 top
LED34  NCD0805R1  [LED0805-R-RD]  52.54 12 90 top
LED35  NCD0805R1  [LED0805-R-RD]  55.08 12 90 top
LED36  NCD0805R1  [LED0805-R-RD]  57.62 12 90 top
LED37  NCD0805R1  [LED0805-R-RD]  60.16 12 90 top
LED38  NCD0805R1  [LED0805-R-RD]  62.7 12 90 top
LED39  NCD0805R1  [LED0805-R-RD]  65.24 12 90 top
LED40  NCD0805R1  [LED0805-R-RD]  67.78 12 90 top
LED41  NCD0805R1  [LED0805-R-RD]  70.32 12 90 top
LED42  NCD0805R1  [LED0805-R-RD]  72.86 12 90 top
LED43  NCD0805R1  [LED0805-R-RD]  75.4 12 90 top
LED44  NCD0805R1  [LED0805-R-RD]  77.94 12 90 top
LED45  NCD0805R1  [LED0805-R-RD]  80.48 12 90 top
LED46  NCD0805R1  [LED0805-R-RD]  88 19.52 180 top
LED47  NCD0805R1  [LED0805-R-RD]  88 22.06 180 top
LED48  NCD0805R1  [LED0805-R-RD]  88 24.6 180 top
LED49  NCD0805R1  [LED0805-R-RD]  88 27.14 180 top
LED50  NCD0805R1  [LED0805-R-RD]  88 29.68 180 top
LED51  NCD0805R1  [LED0805-R-RD]  88 32.22 180 top
LED52  NCD0805R1  [LED0805-R-RD]  88 34.76 180 top
LED53  NCD0805R1  [LED0805-R-RD]  88 37.3 180 top
LED54  NCD0805R1  [LED0805-R-RD]  88 39.84 180 top
LED55  NCD0805R1  [LED0805-R-RD]  88 42.38 180 top
LED56  NCD0805R1  [LED0805-R-RD]  88 50 180 top
LED57  NCD0805R1  [LED0805-R-RD]  88 52.54 180 top
LED58  NCD0805R1  [LED0805-R-RD]  88 55.08 180 top
LED59  NCD0805R1  [LED0805-R-RD]  88 57.62 180 top
LED60  NCD0805R1  [LED0805-R-RD]  88 60.16 180 top
LED61  NCD0805R1  [LED0805-R-RD]  88 62.7 180 top
LED62  NCD0805R1  [LED0805-R-RD]  88 65.24 180 top
LED63  NCD0805R1  [LED0805-R-RD]  88 67.78 180 top
LED64  NCD0805R1  [LED0805-R-RD]  88 70.32 180 top
LED65  NCD0805R1  [LED0805-R-RD]  88 72.86 180 top
LED66  NCD0805R1  [LED0805-R-RD]  88 75.4 180 top
LED67  NCD0805R1  [LED0805-R-RD]  88 77.94 180 top
LED68  NCD0805R1  [LED0805-R-RD]  88 80.48 180 top
LED69  NCD0805R1  [LED0805-R-RD]  80.48 88 270 top
LED70  NCD0805R1  [LED0805-R-RD]  77.94 88 270 top
LED71  NCD0805R1  [LED0805-R-RD]  75.4 88 270 top
LED72  NCD0805R1  [LED0805-R-RD]  72.86 88 270 top
LED73  NCD0805R1  [LED0805-R-RD]  65.24 88 270 top
LED74  NCD0805R1  [LED0805-R-RD]  62.7 88 270 top
LED75  NCD0805R1  [LED0805-R-RD]  60.16 88 270 top
LED76  NCD0805R1  [LED0805-R-RD]  57.62 88 270 top
LED77  NCD0805R1  [LED0805-R-RD]  55.08 88 270 top
LED78  NCD0805R1  [LED0805-R-RD]  52.54 88 270 top
LED79  NCD0805R1  [LED0805-R-RD]  50 88 270 top
LED80  NCD0805R1  [LED0805-R-RD]  47.46 88 270 top
LED81  NCD0805R1  [LED0805-R-RD]  44.92 88 270 top
LED82  NCD0805R1  [LED0805-R-RD]  42.38 88 270 top
LED83  NCD0805R1  [LED0805-R-RD]  39.84 88 270 top
LED84  NCD0805R1  [LED0805-R-RD]  37.3 88 270 top
LED85  NCD0805R1  [LED0805-R-RD]  34.76 88 270 top
LED86  NCD0805R1  [LED0805-R-RD]  32.22 88 270 top
LED87  NCD0805R1  [LED0805-R-RD]  29.68 88 270 top
LED88  NCD0805R1  [LED0805-R-RD]  27.14 88 270 top
POWER  SZYY0805R  [LED0805-R-RD]  10.88 97.5 0 top
R1  1M  [R0805]  43.9 21.43 0 top
R2  1K  [R0805]  15.08 97.5 0 top
R3  10K  [R0805]  21.68 94.83 180 top
R4  1K  [R0805]  7 80.48 0 top
R5  1K  [R0805]  7 77.94 0 top
R6  1K  [R0805]  7 75.4 0 top
R7  1K  [R0805]  7 72.86 0 top
R8  1K  [R0805]  7 70.32 0 top
R9  1K  [R0805]  7 67.78 0 top
R10  1K  [R0805]  7 65.24 0 top
R11  1K  [R0805]  7 62.7 0 top
R84  1K  [R0805]  28.41 77.81 90 top
R85  1K  [R0805]  26 77.81 90 top
R86  1K  [R0805]  7 60.16 0 top
R87  1K  [R0805]  7 52.54 0 top
R88  1K  [R0805]  7 50 0 top
R89  1K  [R0805]  7 47.46 0 top
R90  1K  [R0805]  7 44.92 0 top
R91  1K  [R0805]  7 42.38 0 top
R92  1K  [R0805]  7 39.84 0 top
R93  1K  [R0805]  7 37.3 0 top
R94  1K  [R0805]  7 34.76 0 top
R95  1K  [R0805]  7 32.22 0 top
R96  1K  [R0805]  7 29.68 0 top
R97  1K  [R0805]  7 27.14 0 top
R98  1K  [R0805]  7 24.6 0 top
R99  1K  [R0805]  7 22.06 0 top
R100  1K  [R0805]  7 19.52 0 top
R101  1K  [R0805]  19.52 7 90 top
R102  1K  [R0805]  22.06 7 90 top
R103  1K  [R0805]  24.6 7 90 top
R104  1K  [R0805]  27.14 7 90 top
R105  1K  [R0805]  29.68 7 90 top
R106  1K  [R0805]  42.38 7 90 top
R107  1K  [R0805]  44.92 7 90 top
R108  1K  [R0805]  47.46 7 90 top
R109  1K  [R0805]  50 7 90 top
R110  1K  [R0805]  52.54 7 90 top
R111  1K  [R0805]  55.08 7 90 top
R112  1K  [R0805]  57.62 7 90 top
R113  1K  [R0805]  60.16 7 90 top
R114  1K  [R0805]  62.7 7 90 top
R115  1K  [R0805]  65.24 7 90 top
R116  1K  [R0805]  67.78 7 90 top
R117  1K  [R0805]  70.32 7 90 top
R118  1K  [R0805]  72.86 7 90 top
R119  1K  [R0805]  75.4 7 90 top
R120  1K  [R0805]  77.94 7 90 top
R121  1K  [R0805]  80.48 7 90 top
R122  1K  [R0805]  93 19.52 180 top
R123  1K  [R0805]  93 22.06 180 top
R124  1K  [R0805]  93 24.6 180 top
R125  1K  [R0805]  93 27.14 180 top
R126  1K  [R0805]  93 29.68 180 top
R127  1K  [R0805]  93 32.22 180 top
R128  1K  [R0805]  93 34.76 180 top
R129  1K  [R0805]  93 37.3 180 top
R130  1K  [R0805]  93 39.84 180 top
R131  1K  [R0805]  93 42.38 180 top
R132  1K  [R0805]  93 50 180 top
R133  1K  [R0805]  93 52.54 180 top
R134  1K  [R0805]  93 55.08 180 top
R135  1K  [R0805]  93 57.62 180 top
R136  1K  [R0805]  93 60.16 180 top
R137  1K  [R0805]  93 62.7 180 top
R138  1K  [R0805]  93 65.24 180 top
R139  1K  [R0805]  93 67.78 180 top
R140  1K  [R0805]  93 70.32 180 top
R141  1K  [R0805]  93 72.86 180 top
R142  1K  [R0805]  93 75.4 180 top
R143  1K  [R0805]  93 77.94 180 top
R144  1K  [R0805]  93 80.48 180 top
R145  1K  [R0805]  80.48 93 270 top
R146  1K  [R0805]  77.94 93 270 top
R147  1K  [R0805]  75.4 93 270 top
R148  1K  [R0805]  72.86 93 270 top
R149  1K  [R0805]  65.24 93 270 top
R150  1K  [R0805]  62.7 93 270 top
R151  1K  [R0805]  60.16 93 270 top
R152  1K  [R0805]  57.62 93 270 top
R153  1K  [R0805]  55.08 93 270 top
R154  1K  [R0805]  52.54 93 270 top
R155  1K  [R0805]  50 93 270 top
R156  1K  [R0805]  47.46 93 270 top
R157  1K  [R0805]  44.92 93 270 top
R158  1K  [R0805]  42.38 93 270 top
R159  1K  [R0805]  39.84 93 270 top
R160  1K  [R0805]  37.3 93 270 top
R161  1K  [R0805]  34.76 93 270 top
R162  1K  [R0805]  32.22 93 270 top
R163  1K  [R0805]  29.68 93 270 top
R164  1K  [R0805]  27.14 93 270 top
SCREW1  -  [M3螺丝]  3.5 3.5 0 top
SCREW2  -  [M3螺丝]  96.5 3.5 0 top
SCREW3  -  [M3螺丝]  96.5 96.5 0 top
SCREW4  -  [M3螺丝]  3.5 96.5 0 top
SW1  TS-1101-C-W  [SW-SMD_L6.0-W3.3-LS8.0]  14.31 93.81 0 top
U1  CH340C  [SOP-16_L10.0-W3.9-P1.27-LS6.0-BL]  18.38 86.32 180 top
U2  CS-1166SDIG-2X13(H8.5)  [HDR-TH_26P-P2.54-V-F-R2-C13-S2.54]  25.87 50 270 top
U3  CS-1166SDIG-2X13(H8.5)  [HDR-TH_26P-P2.54-V-F-R2-C13-S2.54]  50 25.87 0 top
U4  CS-1166SDIG-2X13(H8.5)  [HDR-TH_26P-P2.54-V-F-R2-C13-S2.54]  74.13 50 270 top
U5  CS-1166SDIG-2X13(H8.5)  [HDR-TH_26P-P2.54-V-F-R2-C13-S2.54]  50 74.13 0 top
USB1  TYPE-C 16PIN 2MD(073)  [USB-C-SMD_TYPE-C-6PIN-2MD-073]  5.04 88.1 270 top
X1  16MHz  [HC-49US_L11.5-W4.5-P4.88]  44.16 30.82 0 top

## Footprints (pads in the part's own frame, mm; a bottom-side part is the same pattern mirrored in y, then rotated)
C0805
  rect 1.41x1.35 smd: 1(-1,0) 2(1,0)
HC-49US_L11.5-W4.5-P4.88
  rect 1.5x1.5 hole 0.9: 1(-2.44,0)
  round 1.5 hole 0.9: 2(2.44,0)
HDR-TH_6P-P2.54-V-M-R2-C3-S2.54
  rect 1.7x1.7 hole 1.1: 1(-2.54,-1.27)
  round 1.7 hole 1.1: 2(-2.54,1.27) 3(0,-1.27) 4(0,1.27) 5(2.54,-1.27) 6(2.54,1.27)
HDR-TH_25P-P2.54-V-M
  rect 1.6x1.6 hole 1.05: 1(-30.48,0)
  round 1.6 hole 1.05: 2(-27.94,0) 3(-25.4,0) 4(-22.86,0) 5(-20.32,0) 6(-17.78,0) 7(-15.24,0) 8(-12.7,0) 9(-10.16,0) 10(-7.62,0) 11(-5.08,0) 12(-2.54,0) 13(0,0) 14(2.54,0) 15(5.08,0) 16(7.62,0) 17(10.16,0) 18(12.7,0) 19(15.24,0) 20(17.78,0) 21(20.32,0) 22(22.86,0) 23(25.4,0) 24(27.94,0) 25(30.48,0)
HDR-TH_26P-P2.54-V-F-R2-C13-S2.54
  rect 1.6x1.6 hole 1: 1(-15.24,-1.27)
  round 1.6 hole 1: 2(-15.24,1.27) 3(-12.7,-1.27) 4(-12.7,1.27) 5(-10.16,-1.27) 6(-10.16,1.27) 7(-7.62,-1.27) 8(-7.62,1.27) 9(-5.08,-1.27) 10(-5.08,1.27) 11(-2.54,-1.27) 12(-2.54,1.27) 13(0,-1.27) 14(0,1.27) 15(2.54,-1.27) 16(2.54,1.27) 17(5.08,-1.27) 18(5.08,1.27) 19(7.62,-1.27) 20(7.62,1.27) 21(10.16,-1.27) 22(10.16,1.27) 23(12.7,-1.27) 24(12.7,1.27) 25(15.24,-1.27) 26(15.24,1.27)
LED0805-R-RD
  rect 1x1.399 smd: 1(1.05,0) 2(-1.05,0)
M3螺丝
  round 3.2 hole 3.2: 1(-0.064,0.064)
R0805
  rect 1.133x1.377 smd: 1(-1,0) 2(1,0)
SOP-16_L10.0-W3.9-P1.27-LS6.0-BL
  oval 0.56x1.745 smd: 1(-4.445,-2.873) 2(-3.175,-2.873) 3(-1.905,-2.873) 4(-0.635,-2.873) 5(0.635,-2.873) 6(1.905,-2.873) 7(3.175,-2.873) 8(4.445,-2.873) 9(4.445,2.873) 10(3.175,2.873) 11(1.905,2.873) 12(0.635,2.873) 13(-0.635,2.873) 14(-1.905,2.873) 15(-3.175,2.873) 16(-4.445,2.873)
SW-SMD_L6.0-W3.3-LS8.0
  rect 1.9x1.5 smd: 1(-4,0) 2(4,0)
USB-C-SMD_TYPE-C-6PIN-2MD-073
  rect 0.55x1.1 smd: 1(-3.2,2.375) 2(-2.4,2.375) 11(2.4,2.375) 12(3.2,2.375)
  rect 0.3x1.1 smd: 3(-1.75,2.375) 4(-1.25,2.375) 5(-0.75,2.375) 6(-0.25,2.375) 7(0.25,2.375) 8(0.75,2.375) 9(1.25,2.375) 10(1.75,2.375)
  oval 1.1x2 hole 0.6x1.5: 13(-4.325,1.825) 14(4.325,1.825)
  oval 1.2x1.8 hole 0.6x1.2: 13(-4.325,-2.375) 14(4.325,-2.375)

## Nets
As in the schematic.

Pads without a net: SCREW1 1; SCREW2 1; SCREW3 1; SCREW4 1; U1 1 7 8 9 10 11 12 14 15; U2 25; U3 25; U4 2; U5 2; USB1 3 4 9 10 13 14

## Via types
v1: diameter 0.61, hole 0.305, Top Layer to Bottom Layer, 15 vias

## Routing (per net, layer and track width the routed paths; a pad name or vN(x,y) marks a point on that pad's centre or on a via; arc(x,y) is an arc through that point)
+5V: length 481.9
  Top Layer w0.254: C3.2 R3.1 22.68,96.18 22.63,96.23 ; C4.2 23.71,80.35 22.82,81.24 U1.16
  Top Layer w0.508: U4.15 70.96,47.46 70.57,47.84 70.57,69.18 68.67,71.08 60.15,71.08 ; 13.05,55.13 13.1,55.08 U2.9 ; 13.05,55.13 LED11.1 LED12.1 LED13.1 LED14.1 LED15.1 LED16.1 LED17.1 LED18.1 LED19.1 LED20.1 LED21.1 LED22.1 LED23.1 LED24.1 ; 13.05,55.13 13.05,57.65 ; 11.65,84.42 12.53,85.31 22.19,85.31 22.82,84.67 U1.16 ; 11.65,84.42 11.65,83.53 13.05,82.12 LED2.1 LED3.1 LED4.1 LED5.1 LED6.1 LED7.1 LED8.1 LED9.1 LED10.1 13.05,57.65 ; 11.65,84.42 10.38,85.68 v1(9.6,85.68) ; 86.95,44.93 LED56.1 LED57.1 LED58.1 LED59.1 LED60.1 LED61.1 LED62.1 LED63.1 LED64.1 LED65.1 LED66.1 LED67.1 LED68.1 LED69.1 LED70.1 LED71.1 LED72.1 70.29,86.95 ; 86.95,44.93 86.96,44.92 H5.11 ; 86.95,44.93 LED55.1 LED54.1 LED53.1 LED52.1 LED51.1 LED50.1 LED49.1 LED48.1 LED47.1 LED46.1 LED45.1 LED44.1 LED43.1 LED42.1 LED41.1 LED40.1 LED39.1 LED38.1 LED37.1 LED36.1 LED35.1 LED34.1 LED33.1 LED32.1 LED31.1 LED30.1 36.04,13.05 ; 16.33,96.23 16.33,97.24 R2.2 ; 16.33,96.23 16.22,96.23 10.49,90.5 v1(9.6,90.5) ; 16.33,96.23 24.09,96.23 24.85,95.47 24.85,87.72 25.62,86.95 LED88.1 LED87.1 LED86.1 ; U5.21 60.16,71.1 60.15,71.08 ; 14.06,13.04 14.07,13.05 LED25.1 LED26.1 LED27.1 LED28.1 LED29.1 32.18,13.05 ; H3.6 32.22,13.01 32.18,13.05 ; 36.04,13.05 36.04,21.56 37.55,23.08 38.32,23.08 U3.5 ; 36.04,13.05 32.18,13.05 ; 13.05,57.65 13.02,57.62 H2.10 ; LED86.1 32.22,75.4 U5.1 34.76,71.72 35.4,71.08 60.15,71.08 ; LED86.1 LED85.1 LED84.1 LED83.1 LED82.1 LED81.1 LED80.1 LED79.1 LED78.1 LED77.1 LED76.1 LED75.1 LED74.1 LED73.1 70.29,86.95 ; 70.29,86.95 70.32,86.98 H4.5
  Bottom Layer w0.508: v1(9.6,90.5) 11.27,90.5 19.57,98.8
  vias: v1(8.58,90.5) v1(8.56,85.68)
GND:
  vias: v1(2.63,90.16) v1(2.63,89.16) v1(2.63,88.16) v1(2.63,87.16) v1(2.63,86.16) v1(7.2,95.25) v1(7.2,94.32) v1(8.2,95.25) v1(8.2,94.32)
P1: length 36.5
  Top Layer w0.254: H2.1 R4.1
  Bottom Layer w0.254: 1.6,80.48 6.16,80.48 20.13,66.51 25.97,66.51 27.24,65.24
P2: length 46
  Top Layer w0.254: U2.1 24.6,69.3 28.41,73.11 R84.1 ; H2.2 R5.1
  Bottom Layer w0.254: 1.6,77.94 6.03,77.94 18.73,65.24 24.7,65.24
P3: length 53.9
  Top Layer w0.254: R6.1 H2.3 ; R85.1 26,72.61 22.95,69.56 22.95,64.48 23.46,63.97 25.87,63.97 U2.4
  Bottom Layer w0.254: 27.24,62.7 25.97,63.97 17.59,63.97 6.16,75.4 1.6,75.4
P4: length 31.8
  Top Layer w0.254: R7.1 H2.4
  Bottom Layer w0.254: 24.7,62.7 16.19,62.7 6.03,72.86 1.6,72.86
P5: length 34.3
  Top Layer w0.254: R8.1 H2.5
  Bottom Layer w0.254: H2.5 5.93,70.32 14.82,61.43 25.87,61.43 U2.6
P6: length 30.8
  Top Layer w0.254: H2.6 R9.1
  Bottom Layer w0.254: U2.5 13.55,60.16 5.93,67.78 H2.6
P7: length 33.3
  Top Layer w0.254: H2.7 R10.1
  Bottom Layer w0.254: 1.6,65.24 6.16,65.24 12.51,58.89 25.97,58.89 27.24,57.62
P8: length 29.7
  Top Layer w0.254: H2.8 R11.1
  Bottom Layer w0.254: 1.6,62.7 6.03,62.7 11.11,57.62 24.7,57.62
P9: length 32.3
  Top Layer w0.254: H2.9 R86.1
  Bottom Layer w0.254: 1.6,60.16 6.28,60.16 10.09,56.35 26.09,56.35 27.24,55.21 27.24,55.08
P12: length 27.6
  Top Layer w0.254: R87.1 H2.12
  Bottom Layer w0.254: 1.6,52.54 24.7,52.54
P13: length 31.2
  Top Layer w0.254: R88.1 H2.13
  Bottom Layer w0.254: 27.24,50 27.11,50 25.84,51.27 7.43,51.27 6.16,50 1.6,50
P14: length 28.7
  Top Layer w0.254: R89.1 H2.14
  Bottom Layer w0.254: 24.7,50 8.7,50 6.16,47.46 1.6,47.46
P15: length 32.2
  Top Layer w0.254: H2.15 R90.1
  Bottom Layer w0.254: 1.6,44.92 6.03,44.92 9.84,48.73 25.97,48.73 27.24,47.46
P16: length 29.7
  Top Layer w0.254: H2.16 R91.1
  Bottom Layer w0.254: 24.7,47.46 11.11,47.46 6.03,42.38 1.6,42.38
P17: length 33.3
  Top Layer w0.254: H2.17 R92.1
  Bottom Layer w0.254: 27.24,44.92 25.97,46.19 12.38,46.19 6.03,39.84 1.6,39.84
P18: length 30.8
  Top Layer w0.254: H2.18 R93.1
  Bottom Layer w0.254: 1.6,37.3 6.03,37.3 13.65,44.92 24.7,44.92
P19: length 34.3
  Top Layer w0.254: R94.1 H2.19
  Bottom Layer w0.254: 27.24,42.38 25.97,43.65 14.92,43.65 6.03,34.76 1.6,34.76
P20: length 71.7
  Top Layer w0.254: H1.3 9.87,12.15 9.87,14.19 17.49,21.81 17.49,37.43 22.44,42.38 U2.19 ; R95.1 H2.20
  Bottom Layer w0.254: 1.6,32.22 6.16,32.22 16.32,42.38 24.7,42.38
P21: length 73.3
  Top Layer w0.254: R96.1 H2.21 ; H1.4 13.87,10.5 12.83,11.54 12.83,14.61 19.27,21.04 19.27,35.39 22.57,38.7 26,38.7 U2.22
  Bottom Layer w0.254: 1.6,29.68 6.16,29.68 17.59,41.11 25.97,41.11 27.24,39.84
P22: length 66.6
  Top Layer w0.254: 11.52,13.04 11.52,14.82 18.38,21.68 18.38,36.28 21.93,39.84 U2.21 ; H2.22 R97.1
  Bottom Layer w0.254: 1.6,27.14 6.28,27.14 18.98,39.84 24.7,39.84
P23: length 36.5
  Top Layer w0.254: H2.23 R98.1
  Bottom Layer w0.254: 1.6,24.6 6.28,24.6 20.25,38.57 25.97,38.57 27.24,37.3
P24: length 33.9
  Top Layer w0.254: H2.24 R99.1
  Bottom Layer w0.254: U2.23 21.3,37.3 6.06,22.06 H2.24
P25: length 37.5
  Top Layer w0.254: H2.25 R100.1
  Bottom Layer w0.254: H2.25 5.68,19.52 22.19,36.03 25.87,36.03 U2.26
P26: length 36.5
  Top Layer w0.254: R101.1 H3.1
  Bottom Layer w0.254: U3.2 33.49,25.87 33.49,20.03 19.52,6.06 H3.1
P27: length 32.9
  Top Layer w0.254: R102.1 H3.2
  Bottom Layer w0.254: U3.1 34.76,18.63 22.06,5.93 H3.2
P28: length 35.4
  Top Layer w0.254: R103.1 H3.3
  Bottom Layer w0.254: U3.4 36.03,25.87 36.03,17.49 24.6,6.06 H3.3
P29: length 31.8
  Top Layer w0.254: R104.1 H3.4
  Bottom Layer w0.254: H3.4 27.14,5.93 37.3,16.09 U3.3
P30: length 158
  Top Layer w0.254: C5.1 v1(18.38,76.69) ; R3.2 19.33,94.83 SW1.2 18.31,91.96 v1(18.31,91.95) ; H3.5 R105.1
  Bottom Layer w0.254: H3.5 29.68,6.06 38.57,14.95 38.57,25.87 U3.6 39.84,28.79 38.95,29.68 30.72,29.68 ; 30.72,29.68 29.81,28.77 29.81,20.41 15.58,6.19 13.3,6.19 H1.5 ; 30.72,29.68 29.81,30.59 29.81,68.16 26.89,71.08 22.19,71.08 18.31,74.96 v1(18.31,91.95) ; v1(18.38,76.69) 18.34,76.69 18.32,76.66
P35: length 28.7
  Top Layer w0.254: R106.1 H3.10
  Bottom Layer w0.254: U3.9 44.92,4.04 H3.10
P36: length 31.2
  Top Layer w0.254: R107.1 H3.11
  Bottom Layer w0.254: H3.11 46.19,2.77 46.19,25.87 U3.12
P37: length 27.6
  Top Layer w0.254: R108.1 H3.12
  Bottom Layer w0.254: H3.12 U3.11
P38: length 31.2
  Top Layer w0.254: R109.1 H3.13
  Bottom Layer w0.254: U3.14 50,27.01 48.73,25.74 48.73,7.33 50,6.06 H3.13
P39: length 28.7
  Top Layer w0.254: R110.1 H3.14
  Bottom Layer w0.254: U3.13 50,8.6 52.54,6.06 H3.14
P40: length 32.2
  Top Layer w0.254: H3.15 R111.1
  Bottom Layer w0.254: U3.16 51.27,25.87 51.27,9.74 55.08,5.93 H3.15
P41: length 29.7
  Top Layer w0.254: H3.16 R112.1
  Bottom Layer w0.254: U3.15 52.54,11.01 57.62,5.93 H3.16
P42: length 33.3
  Top Layer w0.254: H3.17 R113.1
  Bottom Layer w0.254: U3.18 53.81,25.87 53.81,12.28 60.16,5.93 H3.17
P43: length 30.8
  Top Layer w0.254: H3.18 R114.1
  Bottom Layer w0.254: U3.17 55.08,13.55 62.7,5.93 H3.18
P44: length 34.3
  Top Layer w0.254: R115.1 H3.19
  Bottom Layer w0.254: H3.19 65.24,5.93 56.35,14.82 56.35,25.87 U3.20
P45: length 31.8
  Top Layer w0.254: R116.1 H3.20
  Bottom Layer w0.254: U3.19 57.62,16.22 67.78,6.06 H3.20
P46: length 35.4
  Top Layer w0.254: R117.1 H3.21
  Bottom Layer w0.254: H3.21 70.32,6.06 58.89,17.49 58.89,25.87 U3.22
P47: length 32.9
  Top Layer w0.254: H3.22 R118.1
  Bottom Layer w0.254: H3.22 72.86,6.19 60.16,18.88 U3.21
P48: length 36.5
  Top Layer w0.254: H3.23 R119.1
  Bottom Layer w0.254: H3.23 75.4,6.19 61.43,20.16 61.43,25.87 U3.24
P49: length 33.9
  Top Layer w0.254: H3.24 R120.1
  Bottom Layer w0.254: U3.23 62.7,21.3 77.94,6.06 H3.24
P50: length 37.5
  Top Layer w0.254: H3.25 R121.1
  Bottom Layer w0.254: H3.25 80.48,5.68 63.97,22.19 63.97,25.87 U3.26
P51: length 36.5
  Top Layer w0.254: R122.1 H5.1
  Bottom Layer w0.254: U4.25 74.13,33.49 79.97,33.49 93.94,19.52 H5.1
P52: length 32.9
  Top Layer w0.254: R123.1 H5.2
  Bottom Layer w0.254: U4.26 81.37,34.76 94.07,22.06 H5.2
P53: length 35.4
  Top Layer w0.254: R124.1 H5.3
  Bottom Layer w0.254: H5.3 93.94,24.6 82.51,36.03 74.13,36.03 U4.23
P54: length 31.8
  Top Layer w0.254: R125.1 H5.4
  Bottom Layer w0.254: U4.24 83.91,37.3 94.07,27.14 H5.4
P55: length 34.3
  Top Layer w0.254: R126.1 H5.5
  Bottom Layer w0.254: H5.5 94.07,29.68 85.18,38.57 74.13,38.57 U4.21
P56: length 30.8
  Top Layer w0.254: R127.1 H5.6
  Bottom Layer w0.254: U4.22 86.32,39.84 93.94,32.22 H5.6
P57: length 33.3
  Top Layer w0.254: H5.7 R128.1
  Bottom Layer w0.254: H5.7 93.94,34.76 87.59,41.11 74.13,41.11 U4.19
P58: length 29.7
  Top Layer w0.254: H5.8 R129.1
  Bottom Layer w0.254: H5.8 94.07,37.3 88.99,42.38 U4.20
P59: length 32.3
  Top Layer w0.254: H5.9 R130.1
  Bottom Layer w0.254: U4.17 72.86,44.79 74,43.65 90,43.65 93.81,39.84 H5.9
P60: length 28.7
  Top Layer w0.254: H5.10 R131.1
  Bottom Layer w0.254: U4.18 91.4,44.92 93.94,42.38 H5.10
P63: length 31.2
  Top Layer w0.254: R132.1 H5.13
  Bottom Layer w0.254: H5.13 93.94,50 92.67,48.73 74.26,48.73 72.99,50 U4.13
P64: length 28.7
  Top Layer w0.254: R133.1 H5.14
  Bottom Layer w0.254: H5.14 93.94,52.54 91.4,50 U4.14
P65: length 32.2
  Top Layer w0.254: H5.15 R134.1
  Bottom Layer w0.254: H5.15 94.07,55.08 90.26,51.27 74.13,51.27 U4.11
P66: length 29.7
  Top Layer w0.254: H5.16 R135.1
  Bottom Layer w0.254: U4.12 88.99,52.54 94.07,57.62 H5.16
P67: length 33.3
  Top Layer w0.254: H5.17 R136.1
  Bottom Layer w0.254: U4.9 74.13,53.81 87.72,53.81 94.07,60.16 H5.17
P68: length 30.8
  Top Layer w0.254: H5.18 R137.1
  Bottom Layer w0.254: U4.10 86.45,55.08 94.07,62.7 H5.18
P69: length 34.3
  Top Layer w0.254: R138.1 H5.19
  Bottom Layer w0.254: H5.19 94.07,65.24 85.18,56.35 74.13,56.35 U4.7
P70: length 31.8
  Top Layer w0.254: R139.1 H5.20
  Bottom Layer w0.254: H5.20 93.94,67.78 83.78,57.62 U4.8
P71: length 35.4
  Top Layer w0.254: R140.1 H5.21
  Bottom Layer w0.254: U4.5 74.13,58.89 82.51,58.89 93.94,70.32 H5.21
P72: length 32.9
  Top Layer w0.254: H5.22 R141.1
  Bottom Layer w0.254: U4.6 81.12,60.16 93.81,72.86 H5.22
P73: length 36.5
  Top Layer w0.254: H5.23 R142.1
  Bottom Layer w0.254: U4.3 74.13,61.43 79.84,61.43 93.81,75.4 H5.23
P74: length 33.9
  Top Layer w0.254: H5.24 R143.1
  Bottom Layer w0.254: U4.4 78.7,62.7 93.94,77.94 H5.24
P75: length 37.5
  Top Layer w0.254: H5.25 R144.1
  Bottom Layer w0.254: U4.1 74.13,63.97 77.81,63.97 94.32,80.48 H5.25
P76: length 36.5
  Top Layer w0.254: H4.1 R145.1
  Bottom Layer w0.254: H4.1 80.48,93.94 66.51,79.97 66.51,74.13 U5.25
P77: length 32.9
  Top Layer w0.254: R146.1 H4.2
  Bottom Layer w0.254: H4.2 77.94,94.07 65.24,81.37 U5.26
P78: length 35.4
  Top Layer w0.254: R147.1 H4.3
  Bottom Layer w0.254: U5.23 63.97,74.13 63.97,82.51 75.4,93.94 H4.3
P79: length 31.8
  Top Layer w0.254: R148.1 H4.4
  Bottom Layer w0.254: H4.4 72.86,94.07 62.7,83.91 U5.24
P82: length 33.3
  Top Layer w0.254: H4.7 R149.1
  Bottom Layer w0.254: H4.7 65.24,93.94 58.89,87.59 58.89,74.13 U5.19
P83: length 29.7
  Top Layer w0.254: H4.8 R150.1
  Bottom Layer w0.254: H4.8 62.7,94.07 57.62,88.99 U5.20
P84: length 32.3
  Top Layer w0.254: R151.1 H4.9
  Bottom Layer w0.254: H4.9 60.16,93.81 56.35,90 56.35,74 55.21,72.86 U5.17
P85: length 28.7
  Top Layer w0.254: R152.1 H4.10
  Bottom Layer w0.254: U5.18 55.08,91.4 57.62,93.94 H4.10
P86: length 31.2
  Top Layer w0.254: R153.1 H4.11
  Bottom Layer w0.254: U5.15 53.81,74.13 53.81,92.67 55.08,93.94 H4.11
P87: length 27.6
  Top Layer w0.254: H4.12 R154.1
  Bottom Layer w0.254: H4.12 U5.16
P88: length 31.2
  Top Layer w0.254: H4.13 R155.1
  Bottom Layer w0.254: H4.13 50,93.94 51.27,92.67 51.27,74.26 50,72.99 U5.13
P89: length 28.7
  Top Layer w0.254: H4.14 R156.1
  Bottom Layer w0.254: H4.14 47.46,93.94 50,91.4 U5.14
P90: length 32.2
  Top Layer w0.254: H4.15 R157.1
  Bottom Layer w0.254: H4.15 44.92,94.07 48.73,90.26 48.73,74.13 U5.11
P91: length 29.7
  Top Layer w0.254: R158.1 H4.16
  Bottom Layer w0.254: H4.16 42.38,94.07 47.46,88.99 U5.12
P92: length 33.3
  Top Layer w0.254: R159.1 H4.17
  Bottom Layer w0.254: H4.17 39.84,94.07 46.19,87.72 46.19,74.13 U5.9
P93: length 30.8
  Top Layer w0.254: R160.1 H4.18
  Bottom Layer w0.254: H4.18 37.3,94.07 44.92,86.45 U5.10
P94: length 34.3
  Top Layer w0.254: H4.19 R161.1
  Bottom Layer w0.254: U5.7 43.65,74.13 43.65,85.18 34.76,94.07 H4.19
P95: length 31.8
  Top Layer w0.254: H4.20 R162.1
  Bottom Layer w0.254: H4.20 32.22,93.94 42.38,83.78 U5.8
P96: length 35.4
  Top Layer w0.254: H4.21 R163.1
  Bottom Layer w0.254: H4.21 29.68,93.94 41.11,82.51 41.11,74.13 U5.5
P97: length 32.9
  Top Layer w0.254: H4.22 R164.1
  Bottom Layer w0.254: U5.6 39.84,81.11 27.14,93.81 H4.22
P98: length 32
  Bottom Layer w0.254: H4.23 24.6,93.81 38.57,79.84 38.57,74.13 U5.3
$1N976: length 12.8
  Top Layer w0.254: X1.1 41.72,29.53 41.11,28.92 41.11,25.87 U3.7 42.9,24.08 R1.1 C1.2
$1N982: length 13.5
  Top Layer w0.254: X1.2 46.6,28.82 U3.10 43.78,26 43.78,23.58 44.9,22.46 R1.2 C2.1
$2N435: length 13.8
  Top Layer w0.254: USB1.7 6.56,87.85 6.44,87.97 6.44,88.61 6.68,88.85 USB1.5 10.52,88.85 11.9,87.47 15.96,87.47 16.47,87.97 U1.6
$2N446: length 14.5
  Top Layer w0.254: 8.5,88.35 USB1.6 ; 8.5,88.35 8.5,87.5 8.36,87.35 USB1.8 ; 8.5,88.35 10.25,88.35 11.65,86.96 16.73,86.96 17.74,87.97 U1.5
$2N524: length 4.3
  Top Layer w0.254: C3.1 20.68,91.86 19.01,90.19 U1.4
$2N618: length 6.5
  Top Layer w0.254: U1.13 19.01,79.84 20.17,78.69 C5.2
$2N737: length 2.1
  Top Layer w0.254: POWER.1 R2.1
$2N7582: length 13.7
  Top Layer w0.254: R84.2 28.41,81.75 22.95,87.21 22.06,87.21 21.55,87.72 U1.2
$2N7585: length 13.4
  Top Layer w0.254: U1.3 20.28,87.59 21.42,86.45 22.57,86.45 26,83.02 R85.2
$2N10376: length 2.9
  Top Layer w0.254: LED2.2 R4.2
$2N10378: length 2.9
  Top Layer w0.254: LED3.2 R5.2
$2N10380: length 2.9
  Top Layer w0.254: R6.2 LED4.2
$2N10382: length 2.9
  Top Layer w0.254: R7.2 LED5.2
$2N10384: length 2.9
  Top Layer w0.254: R8.2 LED6.2
$2N10386: length 2.9
  Top Layer w0.254: R9.2 LED7.2
$2N10388: length 2.9
  Top Layer w0.254: R10.2 LED8.2
$2N10390: length 2.9
  Top Layer w0.254: R11.2 LED9.2
$2N10669: length 2.9
  Top Layer w0.254: R86.2 LED10.2
$2N10671: length 2.9
  Top Layer w0.254: R87.2 LED11.2
$2N10673: length 2.9
  Top Layer w0.254: R88.2 LED12.2
$2N10675: length 2.9
  Top Layer w0.254: R89.2 LED13.2
$2N11540: length 2.9
  Top Layer w0.254: R90.2 LED14.2
$2N11542: length 2.9
  Top Layer w0.254: R91.2 LED15.2
$2N11544: length 2.9
  Top Layer w0.254: R92.2 LED16.2
$2N11546: length 2.9
  Top Layer w0.254: R93.2 LED17.2
$2N11548: length 2.9
  Top Layer w0.254: R94.2 LED18.2
$2N11550: length 2.9
  Top Layer w0.254: R95.2 LED19.2
$2N11552: length 2.9
  Top Layer w0.254: R96.2 LED20.2
$2N11554: length 2.9
  Top Layer w0.254: R97.2 LED21.2
$2N11556: length 2.9
  Top Layer w0.254: R98.2 LED22.2
$2N11558: length 2.9
  Top Layer w0.254: R99.2 LED23.2
$2N11560: length 2.9
  Top Layer w0.254: R100.2 LED24.2
$2N11562: length 2.9
  Top Layer w0.254: LED25.2 R101.2
$2N14065: length 2.9
  Top Layer w0.254: R102.2 LED26.2
$2N14067: length 2.9
  Top Layer w0.254: R103.2 LED27.2
$2N14069: length 2.9
  Top Layer w0.254: R104.2 LED28.2
$2N14071: length 2.9
  Top Layer w0.254: R105.2 LED29.2
$2N14073: length 2.9
  Top Layer w0.254: R106.2 LED30.2
$2N14075: length 2.9
  Top Layer w0.254: R107.2 LED31.2
$2N14077: length 2.9
  Top Layer w0.254: R108.2 LED32.2
$2N14079: length 2.9
  Top Layer w0.254: R109.2 LED33.2
$2N14081: length 2.9
  Top Layer w0.254: R110.2 LED34.2
$2N14083: length 2.9
  Top Layer w0.254: R111.2 LED35.2
$2N14085: length 2.9
  Top Layer w0.254: R112.2 LED36.2
$2N14087: length 2.9
  Top Layer w0.254: R113.2 LED37.2
$2N14910: length 2.9
  Top Layer w0.254: R114.2 LED38.2
$2N14912: length 2.9
  Top Layer w0.254: R115.2 LED39.2
$2N14914: length 2.9
  Top Layer w0.254: R116.2 LED40.2
$2N14916: length 2.9
  Top Layer w0.254: R117.2 LED41.2
$2N14918: length 2.9
  Top Layer w0.254: R118.2 LED42.2
$2N14920: length 2.9
  Top Layer w0.254: R119.2 LED43.2
$2N14922: length 2.9
  Top Layer w0.254: R120.2 LED44.2
$2N14924: length 2.9
  Top Layer w0.254: R121.2 LED45.2
$2N14926: length 2.9
  Top Layer w0.254: LED46.2 R122.2
$2N14928: length 2.9
  Top Layer w0.254: LED47.2 R123.2
$2N14930: length 2.9
  Top Layer w0.254: LED48.2 R124.2
$2N14932: length 2.9
  Top Layer w0.254: R125.2 LED49.2
$2N15750: length 2.9
  Top Layer w0.254: R126.2 LED50.2
$2N15752: length 2.9
  Top Layer w0.254: R127.2 LED51.2
$2N15754: length 2.9
  Top Layer w0.254: R128.2 LED52.2
$2N15756: length 2.9
  Top Layer w0.254: R129.2 LED53.2
$2N15758: length 2.9
  Top Layer w0.254: R130.2 LED54.2
$2N15760: length 2.9
  Top Layer w0.254: R131.2 LED55.2
$2N15762: length 2.9
  Top Layer w0.254: R132.2 LED56.2
$2N15764: length 2.9
  Top Layer w0.254: R133.2 LED57.2
$2N15766: length 2.9
  Top Layer w0.254: R134.2 LED58.2
$2N15768: length 2.9
  Top Layer w0.254: R135.2 LED59.2
$2N15770: length 2.9
  Top Layer w0.254: R136.2 LED60.2
$2N15772: length 2.9
  Top Layer w0.254: R137.2 LED61.2
$2N16590: length 2.9
  Top Layer w0.254: R138.2 LED62.2
$2N16592: length 2.9
  Top Layer w0.254: R139.2 LED63.2
$2N16594: length 2.9
  Top Layer w0.254: R140.2 LED64.2
$2N16596: length 2.9
  Top Layer w0.254: R141.2 LED65.2
$2N16598: length 2.9
  Top Layer w0.254: R142.2 LED66.2
$2N16600: length 2.9
  Top Layer w0.254: R143.2 LED67.2
$2N16602: length 2.9
  Top Layer w0.254: R144.2 LED68.2
$2N16604: length 2.9
  Top Layer w0.254: R145.2 LED69.2
$2N16606: length 2.9
  Top Layer w0.254: R146.2 LED70.2
$2N16608: length 2.9
  Top Layer w0.254: R147.2 LED71.2
$2N16610: length 2.9
  Top Layer w0.254: R148.2 LED72.2
$2N16612: length 2.9
  Top Layer w0.254: R149.2 LED73.2
$2N17430: length 2.9
  Top Layer w0.254: R150.2 LED74.2
$2N17432: length 2.9
  Top Layer w0.254: R151.2 LED75.2
$2N17434: length 2.9
  Top Layer w0.254: R152.2 LED76.2
$2N17436: length 2.9
  Top Layer w0.254: R153.2 LED77.2
$2N17438: length 2.9
  Top Layer w0.254: R154.2 LED78.2
$2N17440: length 2.9
  Top Layer w0.254: R155.2 LED79.2
$2N17442: length 2.9
  Top Layer w0.254: R156.2 LED80.2
$2N17444: length 2.9
  Top Layer w0.254: R157.2 LED81.2
$2N17446: length 2.9
  Top Layer w0.254: R158.2 LED82.2
$2N17448: length 2.9
  Top Layer w0.254: R159.2 LED83.2
$2N17450: length 2.9
  Top Layer w0.254: R160.2 LED84.2
$2N17452: length 2.9
  Top Layer w0.254: R161.2 LED85.2
$2N18270: length 2.9
  Top Layer w0.254: R162.2 LED86.2
$2N18272: length 2.9
  Top Layer w0.254: R163.2 LED87.2
$2N18274: length 2.9
  Top Layer w0.254: R164.2 LED88.2

## Copper pours and planes (outline as drawn; the poured copper is in the pictures)
+5V on Top Layer: 7.33,85.98 10.07,85.98 10.07,85.38 7.33,85.38
+5V on Top Layer: 7.27,90.8 10.07,90.8 10.07,90.2 7.27,90.2
+5V on Bottom Layer: 8.22,90.83 10.09,90.83 10.09,85.31 8.22,85.31
GND on Top Layer: 7.17,91.58 9.9,91.58 9.9,91.03 7.17,91.03
GND on Top Layer: 7.41,85.18 10.14,85.18 10.14,84.58 7.41,84.58
GND on Top Layer: 0.01,100 100,100 100,0.02 0.01,0.02
GND on Bottom Layer: -0.11,99.92 99.87,99.92 99.87,-0.06 -0.11,-0.06

Small or netless copper shapes (teardrops, artwork), in the pictures only: 595 on Top Layer, 180 on Bottom Layer

## Text on the board
Top Silkscreen Layer: RST | ICSP | PG5 / PE0 / PE1 / PE2 / PE3 / PE4 / PE5 / PE6 / PE7 / VCC / GND / PH0 / PH1 / PH2 / PH3 / PH4 / PH5 / PH6 / PB0 / PB1 / PB2 / PB3 / PB4 / PB5 / PB6 | PA3 / PA4 / PA5 / PA6 / PA7 / PG2 / PJ6 / PJ5 / PJ4 / PJ3 / PJ2 / PJ1 / PJ0 / GND / VCC / PC7 / PC6 / PC5 / PC4 / PC3 / PC2 / PC1 / PC0 / PG1 / PG0 | PF0 / PF1 / PF2 / PF3 / PF4 / PF5 / PF6 / PF7 / PK0 / PK1 / PK2 / PK3 / PK4 / PK5 / PK6 / PK7 / GND / VCC / PJ7 / PA0 / PA1 / PA2 | PB7 / PH7 / PG3 / PG4 / RST / VCC / GND / PL0 / PL1 / PL2 / PL3 / PL4 / PL5 / PL6 / PL7 / PD0 / PD1 / PD2 / PD3 / PD4 / PD5 / PD6 / PD7 | 17 | 16 | 06 | 07 | 08 | 09 | 53 | 52 | 51 | 50 | 10 | 11 | 12 | 04 | 00 | 01 | 05 | 02 | 03 | 13 | 49 | 48 | 47 | 46 | 45 | 44 | 43 | 42 | 21 | 20 | 19 | 18 | 22 | 23 | 38 | 24 | 25 | 26 | 27 | 28 | 29 | 39 | 30 | 31 | 32 | 33 | 34 | 35 | 36 | 37 | 40 | 41 | 14 | 15
